# Altium project _stm32h7-hmi-display.PrjPCB (part 1 of 2)
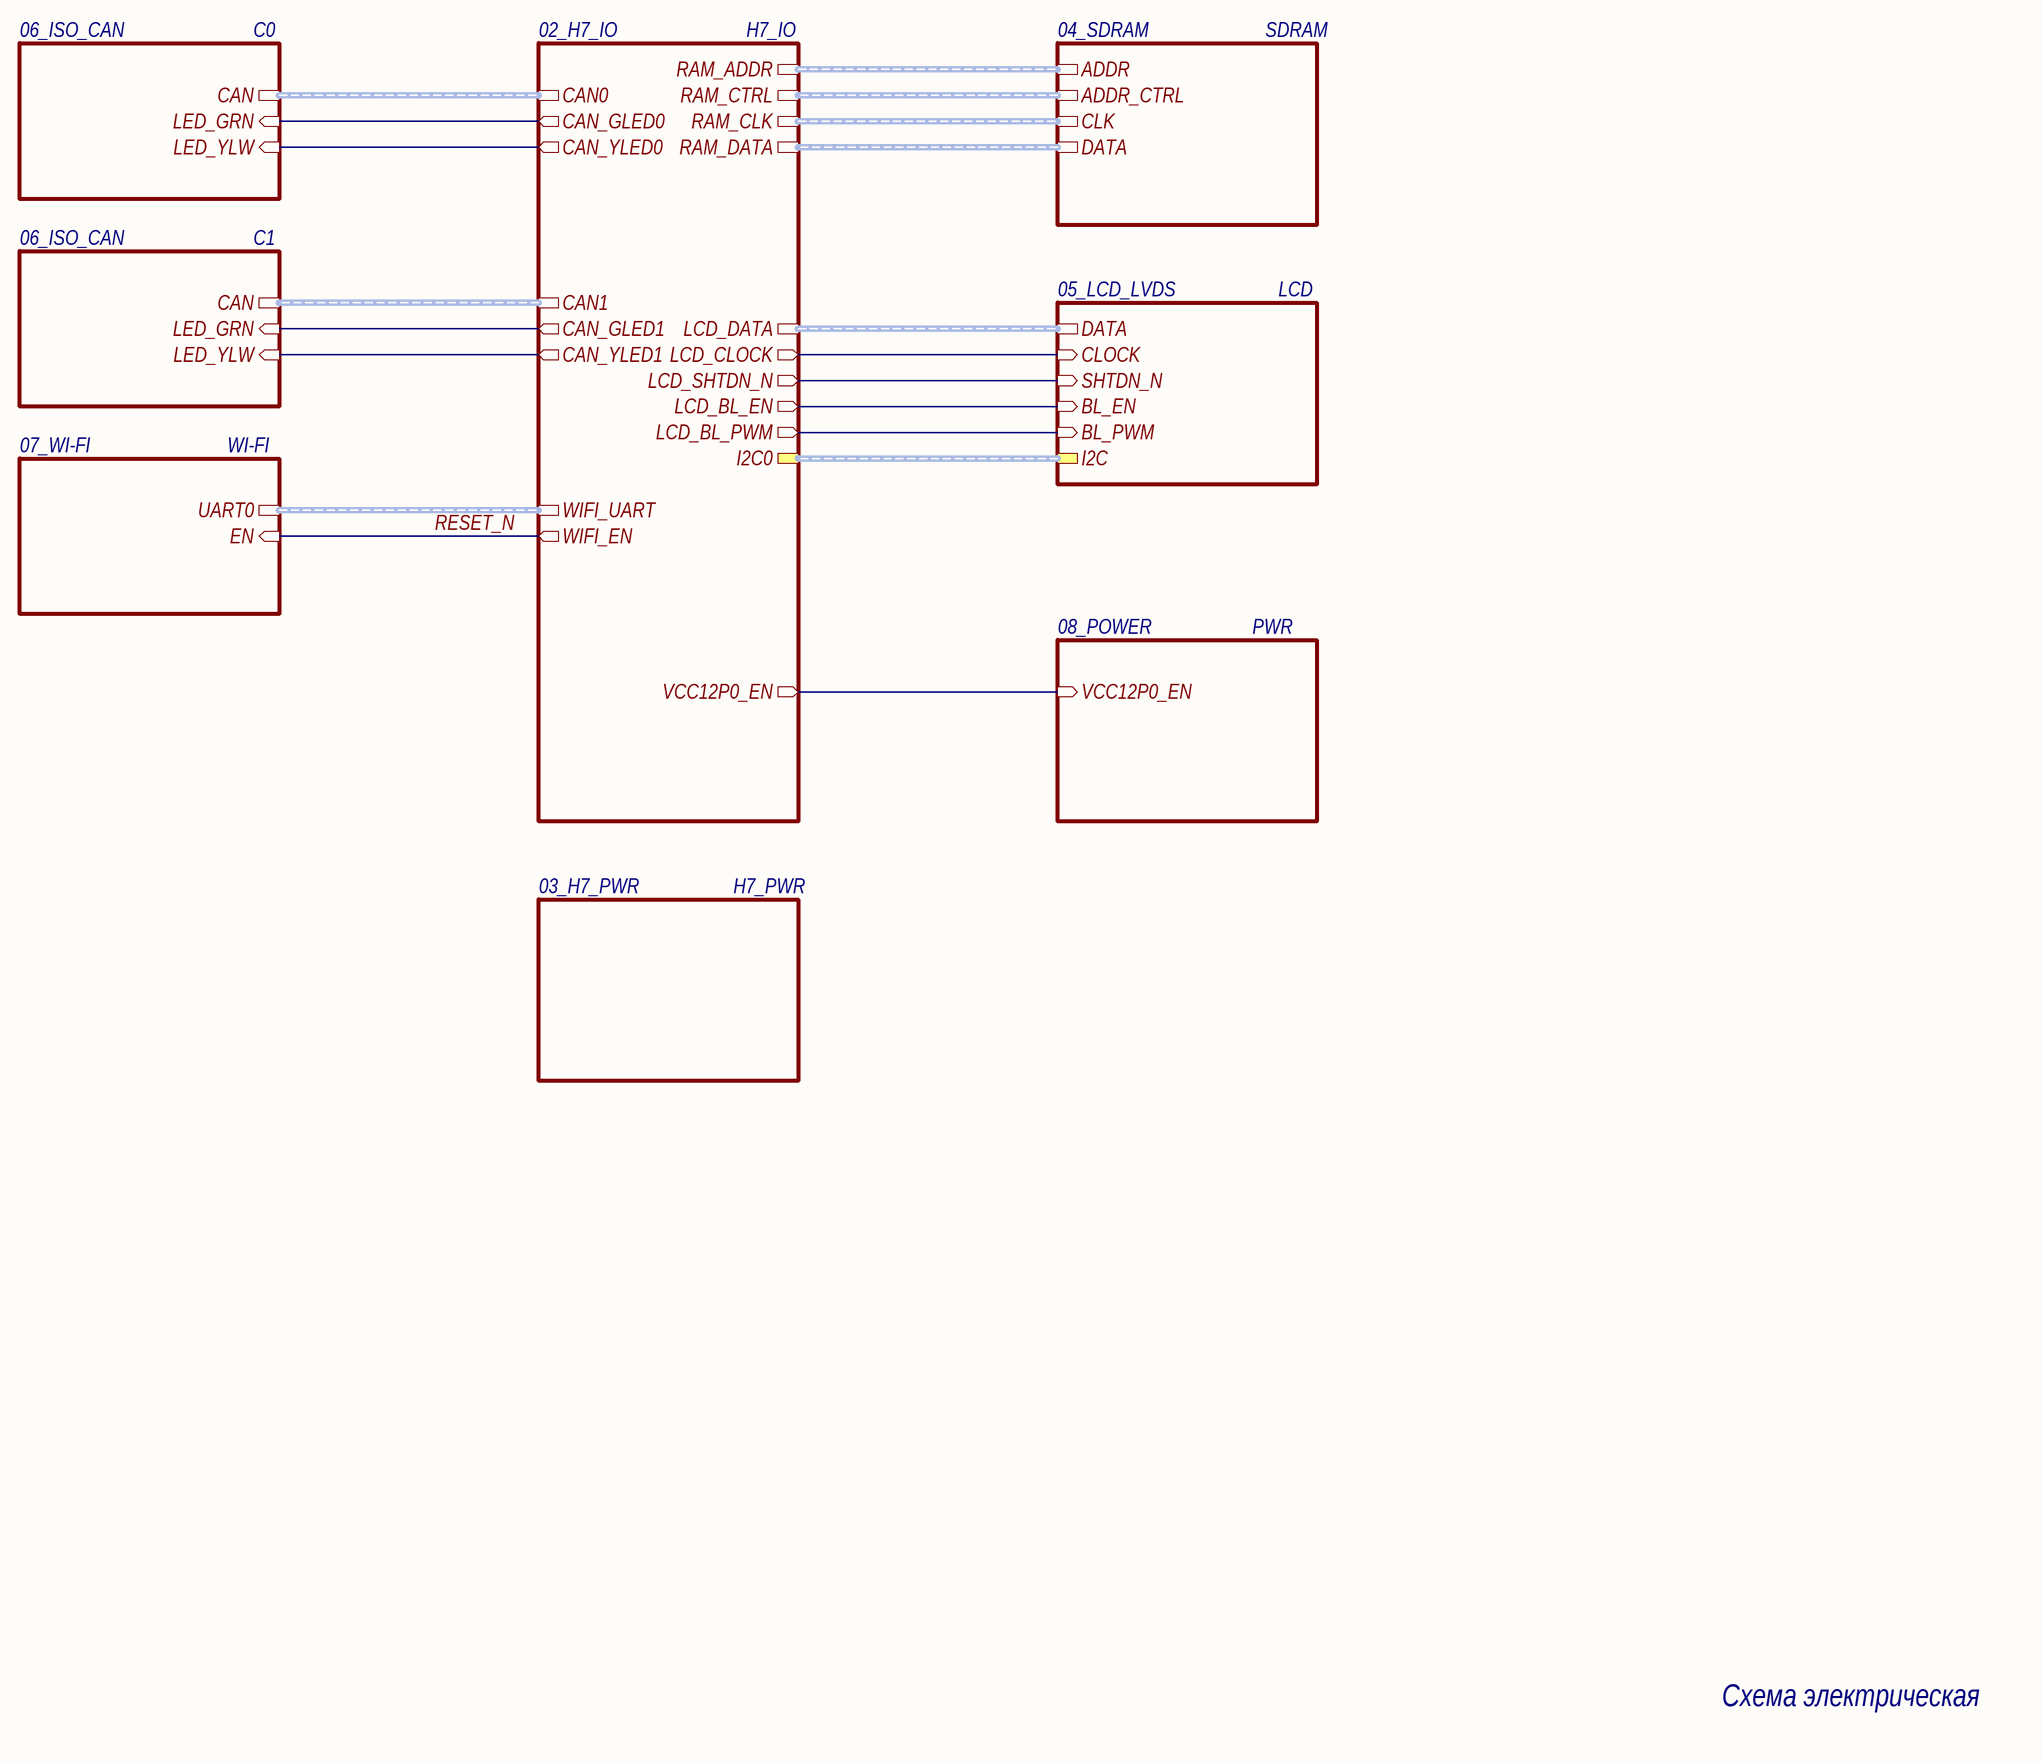
[diagram p0: 01_MAIN.SchDoc]
GlobalOrganizationName: A_D Electronics; GlobalProjectName: stm32h7-hmi-display; GlobalProjectNumber: -; GlobalProjectRevision: 0; PCB_ID: -; PCB_Week: 2024
8 sheets, 164 parts. Net scope: hierarchical (ports join the sheet entries above them; power ports are global).
Board file: PCB.PcbDoc
Sheets:
  01_MAIN.SchDoc
    H7_IO = 02_H7_IO.SchDoc
    SDRAM = 04_SDRAM.SchDoc
    H7_PWR = 03_H7_PWR.SchDoc
    LCD = 05_LCD_LVDS.SchDoc
    C0 = 06_ISO_CAN.SchDoc
    C1 = 06_ISO_CAN.SchDoc
    WI-FI = 07_WI-FI.SchDoc
    PWR = 08_POWER.SchDoc

## Sheet 01_MAIN.SchDoc: =GlobalProjectName
size 594 x 420 mm; ApprovedBy: Галкин; CheckedBy: Галкин; Author: Данич; Organization: A_D Electronics; DocumentNumber: - Э3; Revision: 0; SheetNumber: 1; SheetTotal: 8; PageSetup: Record=PageOptions|CenterHorizontal=True|CenterVertical=True|PrintScale=0.70|XCorrection=1.00|YCorrection=1.00|PrintKind=2|BorderSize=5000000|LeftOffset=9000|BottomOffset=10100|Orientation=2|PaperLength=11176|PaperWidth=8636|Scale=100|PaperSource=259|PrintQuality=-3|MediaType=1|DitherType=10|PrintScaleMode=1|PaperKind=A3|PaperIndex=8; FirstApplication: -; DocumentName: stm32h7-hmi-display

### Sub-sheets
C0 = 06_ISO_CAN: CAN (harness CAN), LED_GRN (in), LED_YLW (in)
C1 = 06_ISO_CAN: CAN (harness CAN), LED_GRN (in), LED_YLW (in)
H7_IO = 02_H7_IO: RAM_DATA (harness SDRAM_DQ), RAM_CTRL (harness SDRAM_ADDR_CTRL), RAM_CLK (harness SDRAM_CLK), RAM_ADDR (harness SDRAM_ADDR), LCD_DATA (harness LCD_DQ), LCD_CLOCK (out), LCD_SHTDN_N (out), CAN_GLED1 (out), CAN_YLED0 (out), CAN1 (harness CAN), CAN0 (harness CAN), WIFI_EN (out), CAN_GLED0 (out), WIFI_UART (harness UART0), CAN_YLED1 (out), LCD_BL_EN (out), LCD_BL_PWM (out), VCC12P0_EN (out), I2C0 (harness I2C)
H7_PWR = 03_H7_PWR: no entries
LCD = 05_LCD_LVDS: DATA (harness LCD_DQ), CLOCK (in), SHTDN_N (in), BL_PWM (in), BL_EN (in), I2C (harness I2C)
PWR = 08_POWER: VCC12P0_EN (in)
SDRAM = 04_SDRAM: DATA (harness SDRAM_DQ), ADDR_CTRL (harness SDRAM_ADDR_CTRL), CLK (harness SDRAM_CLK), ADDR (harness SDRAM_ADDR)
WI-FI = 07_WI-FI: EN (in), UART0 (harness UART0)

### Nets
CAN_GLED0: sheet H7_IO/CAN_GLED0, sheet C0/LED_GRN
CAN_GLED1: sheet H7_IO/CAN_GLED1, sheet C1/LED_GRN
CAN_YLED0: sheet H7_IO/CAN_YLED0, sheet C0/LED_YLW
CAN_YLED1: sheet H7_IO/CAN_YLED1, sheet C1/LED_YLW
LCD_BL_EN: sheet H7_IO/LCD_BL_EN, sheet LCD/BL_EN
LCD_BL_PWM: sheet H7_IO/LCD_BL_PWM, sheet LCD/BL_PWM
LCD_CLK: sheet H7_IO/LCD_CLOCK, sheet LCD/CLOCK
LCD_PWR_EN: sheet H7_IO/VCC12P0_EN, sheet PWR/VCC12P0_EN
RESET_N: sheet H7_IO/LCD_SHTDN_N, sheet H7_IO/WIFI_EN, sheet LCD/SHTDN_N, sheet WI-FI/EN  [project net LCD_SHTDN]

### Buses and harness runs
harness sheet C0/CAN = sheet H7_IO/CAN0
harness sheet C1/CAN = sheet H7_IO/CAN1
harness sheet H7_IO/I2C0 = sheet LCD/I2C
harness sheet H7_IO/LCD_DATA = sheet LCD/DATA
harness sheet H7_IO/RAM_ADDR = sheet SDRAM/ADDR
harness sheet H7_IO/RAM_CLK = sheet SDRAM/CLK
harness sheet H7_IO/RAM_CTRL = sheet SDRAM/ADDR_CTRL
harness sheet H7_IO/RAM_DATA = sheet SDRAM/DATA
harness sheet H7_IO/WIFI_UART = sheet WI-FI/UART0

### Notes on the sheet
- Схема электрическая
  принципиальная
- Перв. примен.
- Справ. №
- Подп. и дата
- Инв. № дубл.
- Взам. инв. №
- Разраб.
- Изм.
- Лист
- № докум.
- Подп.
- Дата
- Литера
- Масса
- Масштаб
- Пров.
- Т.контр.
- Листов
- Инв. № подл.
- Н.контр.
- Утв.
- Форма 1 ГОСТ 2.104-2006
- Копировал
- Формат А2

## Sheet 02_H7_IO.SchDoc: =GlobalProjectName
size 594 x 420 mm; ApprovedBy: Галкин; CheckedBy: Галкин; Author: Данич; Organization: A_D Electronics; DocumentNumber: - Э3; Revision: 0; SheetNumber: 2; SheetTotal: 8; PageSetup: Record=PageOptions|CenterHorizontal=True|CenterVertical=True|PrintScale=0.70|XCorrection=1.00|YCorrection=1.00|PrintKind=2|BorderSize=5000000|LeftOffset=9000|BottomOffset=10100|Orientation=2|PaperLength=11176|PaperWidth=8636|Scale=100|PaperSource=259|PrintQuality=-3|MediaType=1|DitherType=10|PrintScaleMode=1|PaperKind=A3|PaperIndex=8; FirstApplication: -; DocumentName: stm32h7-hmi-display
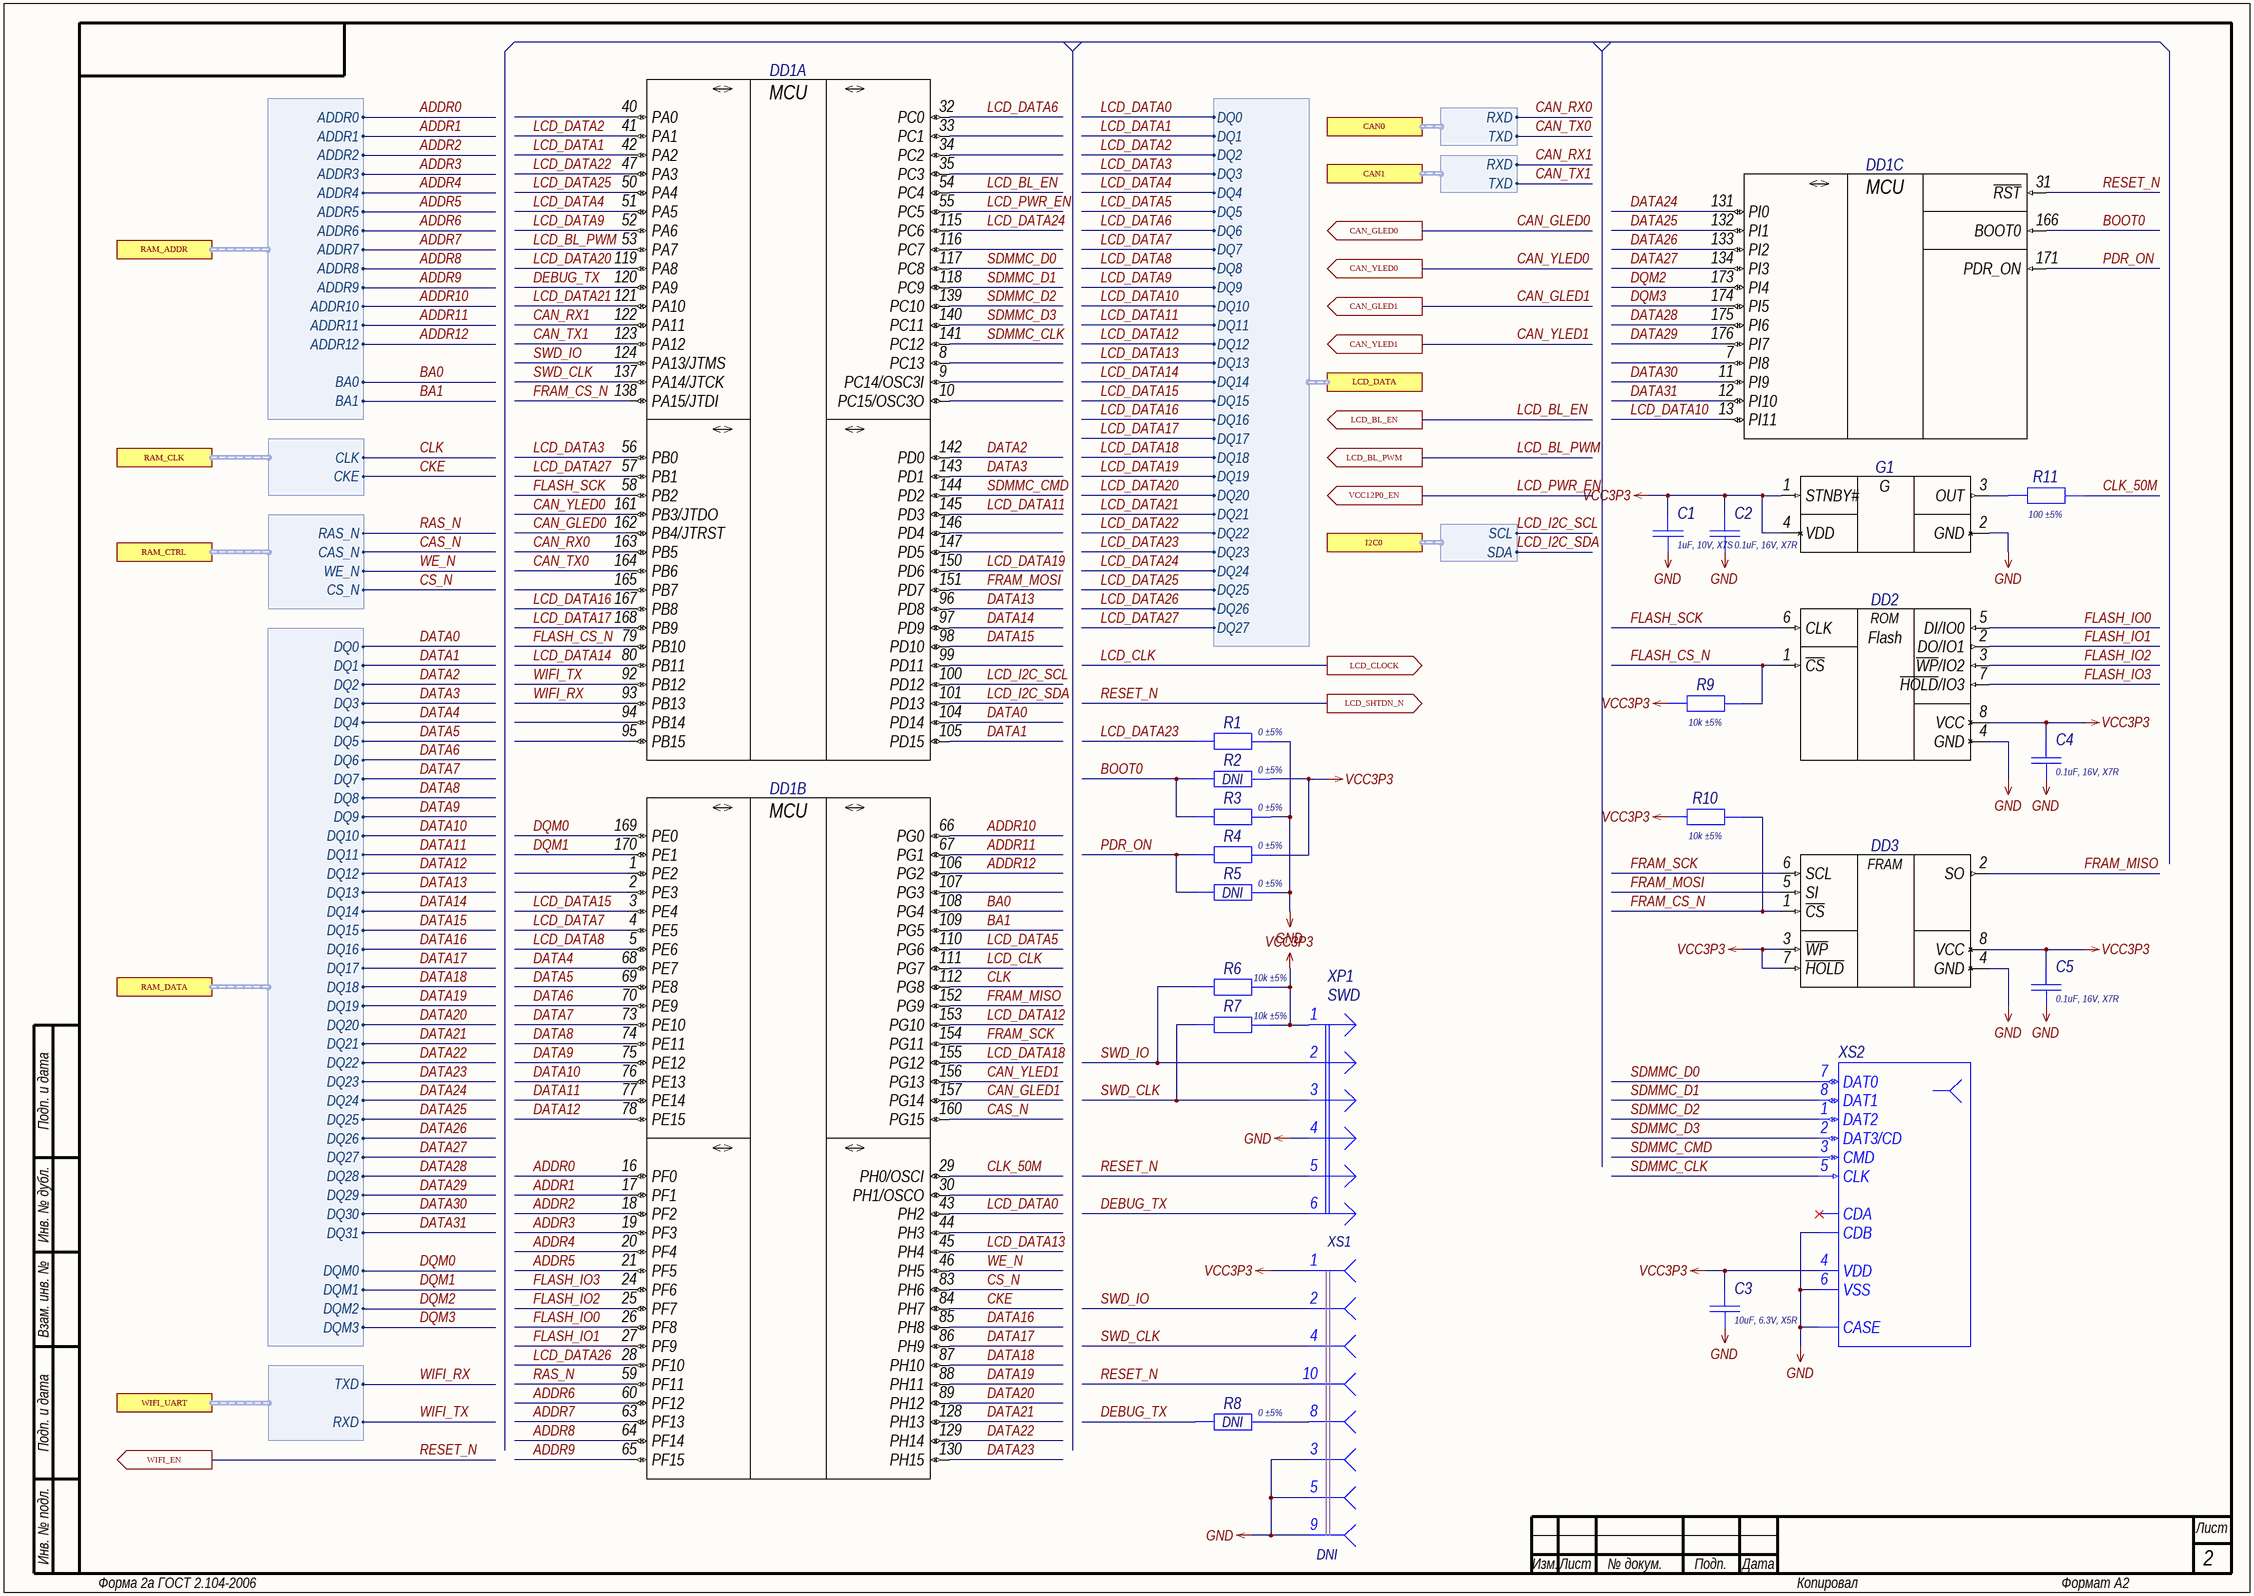
[diagram p1: 02_H7_IO.SchDoc]

### Parts
C1  Schematic Value: 1uF, 10V, X7S  [C0402_L]  (hidden comment: Capacitor)
C2  Schematic Value: 0.1uF, 16V, X7R  [C0402_L]  (hidden comment: Capacitor)
C3  Schematic Value: 10uF, 6.3V, X5R  [C0402_L]  (hidden comment: Capacitor)
C4  Schematic Value: 0.1uF, 16V, X7R  [C0402_L]  (hidden comment: Capacitor)
C5  Schematic Value: 0.1uF, 16V, X7R  [C0402_L]  (hidden comment: Capacitor)
DD1  STM32H743IxT6-Series  [LQFP-176_050P2400X2400X160_N]  (value not drawn)  (parts A,B,C of 4)
DD2  W25Q-Series  [SOIC-8_127P528X528X203_N]  (value not drawn)
DD3  FM25CL64Bx-Series  [SOIC-8_127P490X391X155_N]  (value not drawn)
G1  DSC100X-Series  [CDFN-4_165P250X200X085_N]  (value not drawn)
R1  Schematic Value: 0 ±5%  [R0402_L]  (hidden comment: Resistor)
R2  Schematic Value: 0 ±5%  [R0402_L]  (hidden comment: Resistor)  (no BOM)
R3  Schematic Value: 0 ±5%  [R0402_L]  (hidden comment: Resistor)
R4  Schematic Value: 0 ±5%  [R0402_L]  (hidden comment: Resistor)
R5  Schematic Value: 0 ±5%  [R0402_L]  (hidden comment: Resistor)  (no BOM)
R6  Schematic Value: 10k ±5%  [R0402_L]  (hidden comment: Resistor)
R7  Schematic Value: 10k ±5%  [R0402_L]  (hidden comment: Resistor)
R8  Schematic Value: 0 ±5%  [R0402_L]  (hidden comment: Resistor)  (no BOM)
R9  Schematic Value: 10k ±5%  [R0402_L]  (hidden comment: Resistor)
R10  Schematic Value: 10k ±5%  [R0402_L]  (hidden comment: Resistor)
R11  Schematic Value: 100 ±5%  [R0402_L]  (hidden comment: Resistor)
XP1  SWD  [CWF-6R]
XS1  JTAG  [XF2M-1015-1A]  (value not drawn)  (parts A,B,C,D,E,H,I,J of 10)  (no BOM)
XS2  DM3AT-SF-PEJM5  [DM3AT-SF-PEJM5]  (value not drawn)

### Ports
CAN0 (harness CAN), CAN1 (harness CAN), CAN_GLED0 (out), CAN_GLED1 (out), CAN_YLED0 (out), CAN_YLED1 (out), I2C0 (harness I2C), LCD_BL_EN (out), LCD_BL_PWM (out), LCD_CLOCK (out), LCD_DATA (harness LCD_DQ), LCD_SHTDN_N (out), RAM_ADDR (harness SDRAM_ADDR), RAM_CLK (harness SDRAM_CLK), RAM_CTRL (harness SDRAM_ADDR_CTRL), RAM_DATA (harness SDRAM_DQ), VCC12P0_EN (out), WIFI_EN (out), WIFI_UART (harness UART0)

### Harnesses
SDRAM_ADDR: BA0, BA1, ADDR12, ADDR11, ADDR10, ADDR9, ADDR8, ADDR7, ADDR6, ADDR5, ADDR4, ADDR3, ADDR2, ADDR1, ADDR0
SDRAM_ADDR_CTRL: RAS_N, CAS_N, WE_N, CS_N
SDRAM_CLK: CLK, CKE
SDRAM_DQ: DQ0, DQ1, DQ2, DQ3, DQ4, DQ5, DQ6, DQ7, DQ8, DQ9, DQ10, DQ11, DQ12, DQ13, DQ14, DQ15, DQ16, DQ17, DQ18, DQ19, DQ20, DQ21, DQ22, DQ23, DQ24, DQ25, DQ26, DQ27, DQ28, DQ29, DQ30, DQ31, DQM0, DQM1, DQM2, DQM3
LCD_DQ: DQ0, DQ1, DQ2, DQ3, DQ4, DQ5, DQ6, DQ7, DQ8, DQ9, DQ10, DQ11, DQ12, DQ13, DQ14, DQ15, DQ16, DQ17, DQ18, DQ19, DQ20, DQ21, DQ22, DQ23, DQ24, DQ25, DQ26, DQ27
UART0: RXD, TXD
CAN: RXD, TXD
I2C: SCL, SDA

### Nets
GND: C1.1 C2.1 C3.1 C4.1 C5.1 DD2.4(GND) DD3.4(GND) G1.2(GND) R1.2 R3.2 R5.2 XP1.4 XS1.3 XS1.5 XS1.9 XS2.6(VSS) XS2.CASE XS2.CDB
VCC3P3: C1.2 C2.2 C3.2 C4.2 C5.2 DD2.8(VCC) DD3.3(~{WP}) DD3.7(~{HOLD}) DD3.8(VCC) G1.1(STNBY#) G1.4(VDD) R2.2 R4.2 R6.1 R7.1 R9.2 R10.2 XP1.1 XS1.1 XS2.4(VDD)
ADDR0: DD1.16(PF0) ; port RAM_ADDR.ADDR0
ADDR1: DD1.17(PF1) ; port RAM_ADDR.ADDR1
ADDR2: DD1.18(PF2) ; port RAM_ADDR.ADDR2
ADDR3: DD1.19(PF3) ; port RAM_ADDR.ADDR3
ADDR4: DD1.20(PF4) ; port RAM_ADDR.ADDR4
ADDR5: DD1.21(PF5) ; port RAM_ADDR.ADDR5
ADDR6: DD1.60(PF12) ; port RAM_ADDR.ADDR6
ADDR7: DD1.63(PF13) ; port RAM_ADDR.ADDR7
ADDR8: DD1.64(PF14) ; port RAM_ADDR.ADDR8
ADDR9: DD1.65(PF15) ; port RAM_ADDR.ADDR9
ADDR10: DD1.66(PG0) ; port RAM_ADDR.ADDR10
ADDR11: DD1.67(PG1) ; port RAM_ADDR.ADDR11
ADDR12: DD1.106(PG2) ; port RAM_ADDR.ADDR12
BA0: DD1.108(PG4) ; port RAM_ADDR.BA0
BA1: DD1.109(PG5) ; port RAM_ADDR.BA1
BOOT0: DD1.166(BOOT0) R2.1 R3.1
CAN_GLED0: DD1.162(PB4/JTRST) ; port CAN_GLED0
CAN_GLED1: DD1.157(PG14) ; port CAN_GLED1
CAN_RX0: DD1.163(PB5) ; port CAN0.RXD
CAN_RX1: DD1.122(PA11) ; port CAN1.RXD
CAN_TX0: DD1.164(PB6) ; port CAN0.TXD
CAN_TX1: DD1.123(PA12) ; port CAN1.TXD
CAN_YLED0: DD1.161(PB3/JTDO) ; port CAN_YLED0
CAN_YLED1: DD1.156(PG13) ; port CAN_YLED1
CAS_N: DD1.160(PG15) ; port RAM_CTRL.CAS_N
CKE: DD1.84(PH7) ; port RAM_CLK.CKE
CLK: DD1.112(PG8) ; port RAM_CLK.CLK
CLK_50M: DD1.29(PH0/OSCI) R11.2
CS_N: DD1.83(PH6) ; port RAM_CTRL.CS_N
DATA0: DD1.104(PD14) ; port RAM_DATA.DQ0
DATA1: DD1.105(PD15) ; port RAM_DATA.DQ1
DATA2: DD1.142(PD0) ; port RAM_DATA.DQ2
DATA3: DD1.143(PD1) ; port RAM_DATA.DQ3
DATA4: DD1.68(PE7) ; port RAM_DATA.DQ4
DATA5: DD1.69(PE8) ; port RAM_DATA.DQ5
DATA6: DD1.70(PE9) ; port RAM_DATA.DQ6
DATA7: DD1.73(PE10) ; port RAM_DATA.DQ7
DATA8: DD1.74(PE11) ; port RAM_DATA.DQ8
DATA9: DD1.75(PE12) ; port RAM_DATA.DQ9
DATA10: DD1.76(PE13) ; port RAM_DATA.DQ10
DATA11: DD1.77(PE14) ; port RAM_DATA.DQ11
DATA12: DD1.78(PE15) ; port RAM_DATA.DQ12
DATA13: DD1.96(PD8) ; port RAM_DATA.DQ13
DATA14: DD1.97(PD9) ; port RAM_DATA.DQ14
DATA15: DD1.98(PD10) ; port RAM_DATA.DQ15
DATA16: DD1.85(PH8) ; port RAM_DATA.DQ16
DATA17: DD1.86(PH9) ; port RAM_DATA.DQ17
DATA18: DD1.87(PH10) ; port RAM_DATA.DQ18
DATA19: DD1.88(PH11) ; port RAM_DATA.DQ19
DATA20: DD1.89(PH12) ; port RAM_DATA.DQ20
DATA21: DD1.128(PH13) ; port RAM_DATA.DQ21
DATA22: DD1.129(PH14) ; port RAM_DATA.DQ22
DATA23: DD1.130(PH15) ; port RAM_DATA.DQ23
DATA24: DD1.131(PI0) ; port RAM_DATA.DQ24
DATA25: DD1.132(PI1) ; port RAM_DATA.DQ25
DATA26: DD1.133(PI2) ; port RAM_DATA.DQ26
DATA27: DD1.134(PI3) ; port RAM_DATA.DQ27
DATA28: DD1.175(PI6) ; port RAM_DATA.DQ28
DATA29: DD1.176(PI7) ; port RAM_DATA.DQ29
DATA30: DD1.11(PI9) ; port RAM_DATA.DQ30
DATA31: DD1.12(PI10) ; port RAM_DATA.DQ31
DEBUG_TX: DD1.120(PA9) R8.1 XP1.6
DQM0: DD1.169(PE0) ; port RAM_DATA.DQM0
DQM1: DD1.170(PE1) ; port RAM_DATA.DQM1
DQM2: DD1.173(PI4) ; port RAM_DATA.DQM2
DQM3: DD1.174(PI5) ; port RAM_DATA.DQM3
FLASH_CS_N: DD1.79(PB10) DD2.1(~{CS}) R9.1
FLASH_IO0: DD1.26(PF8) DD2.5(DI/IO0)
FLASH_IO1: DD1.27(PF9) DD2.2(DO/IO1)
FLASH_IO2: DD1.25(PF7) DD2.3(~{WP}/IO2)
FLASH_IO3: DD1.24(PF6) DD2.7(~{HOLD}/IO3)
FLASH_SCK: DD1.58(PB2) DD2.6(CLK)
FRAM_CS_N: DD1.138(PA15/JTDI) DD3.1(~{CS}) R10.1
FRAM_MISO: DD1.152(PG9) DD3.2(SO)
FRAM_MOSI: DD1.151(PD7) DD3.5(SI)
FRAM_SCK: DD1.154(PG11) DD3.6(SCL)
LCD_BL_EN: DD1.54(PC4) ; port LCD_BL_EN
LCD_BL_PWM: DD1.53(PA7) ; port LCD_BL_PWM
LCD_CLK: DD1.111(PG7) ; port LCD_CLOCK
LCD_DATA0: DD1.43(PH2) ; port LCD_DATA.DQ0
LCD_DATA1: DD1.42(PA2) ; port LCD_DATA.DQ1
LCD_DATA2: DD1.41(PA1) ; port LCD_DATA.DQ2
LCD_DATA3: DD1.56(PB0) ; port LCD_DATA.DQ3
LCD_DATA4: DD1.51(PA5) ; port LCD_DATA.DQ4
LCD_DATA5: DD1.110(PG6) ; port LCD_DATA.DQ5
LCD_DATA6: DD1.32(PC0) ; port LCD_DATA.DQ6
LCD_DATA7: DD1.4(PE5) ; port LCD_DATA.DQ7
LCD_DATA8: DD1.5(PE6) ; port LCD_DATA.DQ8
LCD_DATA9: DD1.52(PA6) ; port LCD_DATA.DQ9
LCD_DATA10: DD1.13(PI11) ; port LCD_DATA.DQ10
LCD_DATA11: DD1.145(PD3) ; port LCD_DATA.DQ11
LCD_DATA12: DD1.153(PG10) ; port LCD_DATA.DQ12
LCD_DATA13: DD1.45(PH4) ; port LCD_DATA.DQ13
LCD_DATA14: DD1.80(PB11) ; port LCD_DATA.DQ14
LCD_DATA15: DD1.3(PE4) ; port LCD_DATA.DQ15
LCD_DATA16: DD1.167(PB8) ; port LCD_DATA.DQ16
LCD_DATA17: DD1.168(PB9) ; port LCD_DATA.DQ17
LCD_DATA18: DD1.155(PG12) ; port LCD_DATA.DQ18
LCD_DATA19: DD1.150(PD6) ; port LCD_DATA.DQ19
LCD_DATA20: DD1.119(PA8) ; port LCD_DATA.DQ20
LCD_DATA21: DD1.121(PA10) ; port LCD_DATA.DQ21
LCD_DATA22: DD1.47(PA3) ; port LCD_DATA.DQ22
LCD_DATA23: R1.1 ; port LCD_DATA.DQ23
LCD_DATA24: DD1.115(PC6) ; port LCD_DATA.DQ24
LCD_DATA25: DD1.50(PA4) ; port LCD_DATA.DQ25
LCD_DATA26: DD1.28(PF10) ; port LCD_DATA.DQ26
LCD_DATA27: DD1.57(PB1) ; port LCD_DATA.DQ27
LCD_I2C_SCL: DD1.100(PD12) ; port I2C0.SCL
LCD_I2C_SDA: DD1.101(PD13) ; port I2C0.SDA
LCD_PWR_EN: DD1.55(PC5) ; port VCC12P0_EN
PDR_ON: DD1.171(PDR_ON) R4.1 R5.1
RAS_N: DD1.59(PF11) ; port RAM_CTRL.RAS_N
RESET_N: DD1.31(~{RST}) XP1.5 XS1.10 ; port LCD_SHTDN_N, port WIFI_EN  [project net LCD_SHTDN]
SDMMC_CLK: DD1.141(PC12) XS2.5(CLK)
SDMMC_CMD: DD1.144(PD2) XS2.3(CMD)
SDMMC_D0: DD1.117(PC8) XS2.7(DAT0)
SDMMC_D1: DD1.118(PC9) XS2.8(DAT1)
SDMMC_D2: DD1.139(PC10) XS2.1(DAT2)
SDMMC_D3: DD1.140(PC11) XS2.2(DAT3/CD)
SWD_CLK: DD1.137(PA14/JTCK) R7.2 XP1.3 XS1.4
SWD_IO: DD1.124(PA13/JTMS) R6.2 XP1.2 XS1.2
WE_N: DD1.46(PH5) ; port RAM_CTRL.WE_N
WIFI_RX: DD1.93(PB13) ; port WIFI_UART.TXD
WIFI_TX: DD1.92(PB12) ; port WIFI_UART.RXD
NetG1_3: G1.3(OUT) R11.1
NetR8_2: R8.2 XS1.8

Not connected (* = marked no-connect by the designer): DD1 1(PE2) 2(PE3) 7(PI8) 8(PC13) 9(PC14/OSC3I) 10(PC15/OSC3O) 30(PH1/OSCO) 33(PC1) 34(PC2) 35(PC3) 40(PA0) 44(PH3) 94(PB14) 95(PB15) 99(PD11) 107(PG3) 116(PC7) 146(PD4) 147(PD5) 165(PB7); XS2 CDA*

### Notes on the sheet
- (near R2) DNI
- (near R5) DNI
- XS1
- (near R8) DNI
- (near XS1) DNI
- Подп. и дата
- Инв. № дубл.
- Взам. инв. №
- Инв. № подл.
- Изм.
- Лист
- № докум.
- Подп.
- Дата
- Форма 2а ГОСТ 2.104-2006
- Копировал
- Формат А2
- (in symbol DSC1001DI5-050.0000) G
- (in symbol FM25CL64B-G) FRAM
- (in symbol STM32H743IIT6, part A) MCU
- (in symbol STM32H743IIT6, part B) MCU
- (in symbol STM32H743IIT6, part C) MCU
- (in symbol W25Q128JVSIQ) ROM; Flash

### Library data of the parts
C1 = GRM155C71A105KE11D: Manufacturer: Murata; Type: Конденсатор; ID: 179; Value: 1uF; Voltage: 10V; Tolerance: ±10%; Dielectric Type: X7S; Application Category: 1; Working Temperature Min: -55°С; Working Temperature Max: +125°С; Published: 18.05.2010; Publisher: Andrew Danich; Part Number: GRM155C71A105KE11D; Footprint: 0402
C2 C4 C5 = GCM155R71C104KA55D: Manufacturer: Murata; Type: Конденсатор; ID: 163; Value: 0.1uF; Voltage: 16V; Tolerance: ±10%; Dielectric Type: X7R; Application Category: 1; Working Temperature Min: -55°С; Working Temperature Max: +125°С; Functional Analog: GRM155R71C104KA88D; Published: 18.05.2010; Publisher: Andrew Danich; Part Number: GCM155R71C104KA55D; Footprint: 0402
C3 = GRM155R60J106ME15D: Manufacturer: Murata; Type: Конденсатор; ID: 234; Value: 10uF; Voltage: 6.3V; Tolerance: ±20%; Dielectric Type: X5R; Application Category: 1; Working Temperature Min: -55°С; Working Temperature Max: +85°С; Published: 18.05.2010; Publisher: Andrew Danich; Part Number: GRM155R60J106ME15D; Footprint: 0402
DD1 = STM32H743IIT6: Manufacturer: STMicroelectronics; ID: 36; Supply Operation: +1.62…3.6V; Flash: 2M; SRAM: 1M; Prog Interface: JTAG, SWD, UART, USB; I/O Lines: 140; Operation Frequency: 400MHz; Application Category: 1; Working Temperature Min: -40°С; Working Temperature Max: +85°С; Published: 19.05.2020; Publisher: Andrew Danich; Type: Микросхема; Part Number: STM32H743IIT6; Value: STM32H743IIT6
DD2 = W25Q128JVSIQ: Manufacturer: Winbond; ID: 21; Supply Operation: +2.7…3.6V; Supply Current: 25mA; Memory: 16M; Addressable: NO; Clock Frequency: 133MHz; Application Category: 1; Working Temperature Min: -40°С; Working Temperature Max: +85°С; Interface: SPI; Published: 11.06.2017; Type: Микросхема; Publisher: Andrew Danich; Part Number: W25Q128JVSIQ; Value: W25Q128JVSIQ
DD3 = FM25CL64B-G: Manufacturer: Cypress Semiconductor; ID: 2; Supply Operation: +2.7…3.6V; Supply Current: 3mA; Memory: 64Kb; Addressable: NO; Interface: SPI; Clock Frequency: 20MHz; Application Category: 1; Working Temperature Min: -40°С; Working Temperature Max: +85°С; Functional Analog: FM25CL64B-GTR; Published: 21.05.2020; Type: Микросхема; Publisher: Andrew Danich; Part Number: FM25CL64B-G; Value: FM25CL64B-G
G1 = DSC1001DI5-050.0000: Manufacturer: Microchip; ID: 12; Supply Operation: +1.7…3.6V; Supply Current: 8.5mA; Output Voltage: 0.2VCC…0.8VCC; Temperature Coefficient: 10ppm; Shutdown Input: Yes; Output Signal: CMOS; Output Frequency: 50MHz; Application Category: 1; Working Temperature Min: -40°С; Working Temperature Max: +85°С; Functional Analog: DSC1001DI5-050.0000T; Published: 07.06.2018; Publisher: Andrew Danich; Type: Генератор; Part Number: DSC1001DI5-050.0000; Value: DSC1001DI5-050.0000
R1-R5 R8 = RC0402JR-070RL: Manufacturer: Yageo; ID: 362; Value: 0; Limit Voltage: 50V; Tolerance: ±5%; Temperature Coefficient: 100ppm; Total Power Dissipation: 0.1W; Series Type: Thick-Film; Application Category: 1; Working Temperature Min: -55°С; Working Temperature Max: +155°С; Published: 24.03.2010; Publisher: Andrew Danich; Type: Резистор; Part Number: RC0402JR-070RL; Footprint: 0402
R6 R7 R9 R10 = RC0402JR-0710KL: Manufacturer: Yageo; ID: 476; Value: 10k; Limit Voltage: 50V; Tolerance: ±5%; Temperature Coefficient: 100ppm; Total Power Dissipation: 0.1W; Series Type: Thick-Film; Application Category: 1; Working Temperature Min: -55°С; Working Temperature Max: +155°С; Published: 24.03.2010; Publisher: Andrew Danich; Type: Резистор; Part Number: RC0402JR-0710KL; Footprint: 0402
R11 = RC0402JR-07100RL: Manufacturer: Yageo; ID: 479; Value: 100; Limit Voltage: 50V; Tolerance: ±5%; Temperature Coefficient: 100ppm; Total Power Dissipation: 0.1W; Series Type: Thick-Film; Application Category: 1; Working Temperature Min: -55°С; Working Temperature Max: +155°С; Published: 24.03.2010; Publisher: Andrew Danich; Type: Резистор; Part Number: RC0402JR-07100RL; Footprint: 0402
XP1 = CWF-6R: Manufacturer: Ningbo Zhenqin Electronic; Value: CWF-6R; ID: 128; Limit Voltage: 250V; Limit Current: 3A; Connector Type: Male; Surface Finish: Phosphor Bronze; Pitch: 2.5mm; Application Category: 1; Working Temperature Min: -30°С; Working Temperature Max: +90°С; Functional Analog: DS1069-6 MR; Published: 07.03.2013; Publisher: Andrew Danich; Type: Вилка; Part Number: CWF-6R; Pins: 6
XS1 = XF2M-1015-1A: Manufacturer: Omron Electronics; ID: 7; Limit Voltage: 50V; Limit Current: 500mA; Connector Type: Female; Resistance: 0.05ohm; Pitch: 0.5mm; Application Category: 1; Working Temperature Min: -30°С; Working Temperature Max: +85°С; Published: 07.09.2015; Publisher: Viktor Klishin; Type: Розетка; Part Number: XF2M-1015-1A; Value: XF2M-1015-1A; Pins: 10; Series: FPC
XS2 = DM3AT-SF-PEJM5: Manufacturer: Hirose Connector; ID: 5; Limit Voltage: 125V; Style: Push-Push; Connector Type: microSD Card; Interface: SPI\SDIO; Pitch: 1.1mm; Application Category: 1; Working Temperature Min: -25°С; Working Temperature Max: +85°С; Value: DM3AT-SF-PEJM5; Published: 14.03.2019; Publisher: Andrew Danich; Type: Розетка; Part Number: DM3AT-SF-PEJM5; Pins: 10

## Sheet 04_SDRAM.SchDoc: =GlobalProjectName
size 594 x 420 mm; ApprovedBy: Галкин; CheckedBy: Галкин; Author: Данич; Organization: A_D Electronics; DocumentNumber: - Э3; Revision: 0; SheetNumber: 4; SheetTotal: 8; PageSetup: Record=PageOptions|CenterHorizontal=True|CenterVertical=True|PrintScale=0.70|XCorrection=1.00|YCorrection=1.00|PrintKind=2|BorderSize=5000000|LeftOffset=9000|BottomOffset=10100|Orientation=2|PaperLength=11176|PaperWidth=8636|Scale=100|PaperSource=259|PrintQuality=-3|MediaType=1|DitherType=10|PrintScaleMode=1|PaperKind=A3|PaperIndex=8; FirstApplication: -; DocumentName: stm32h7-hmi-display
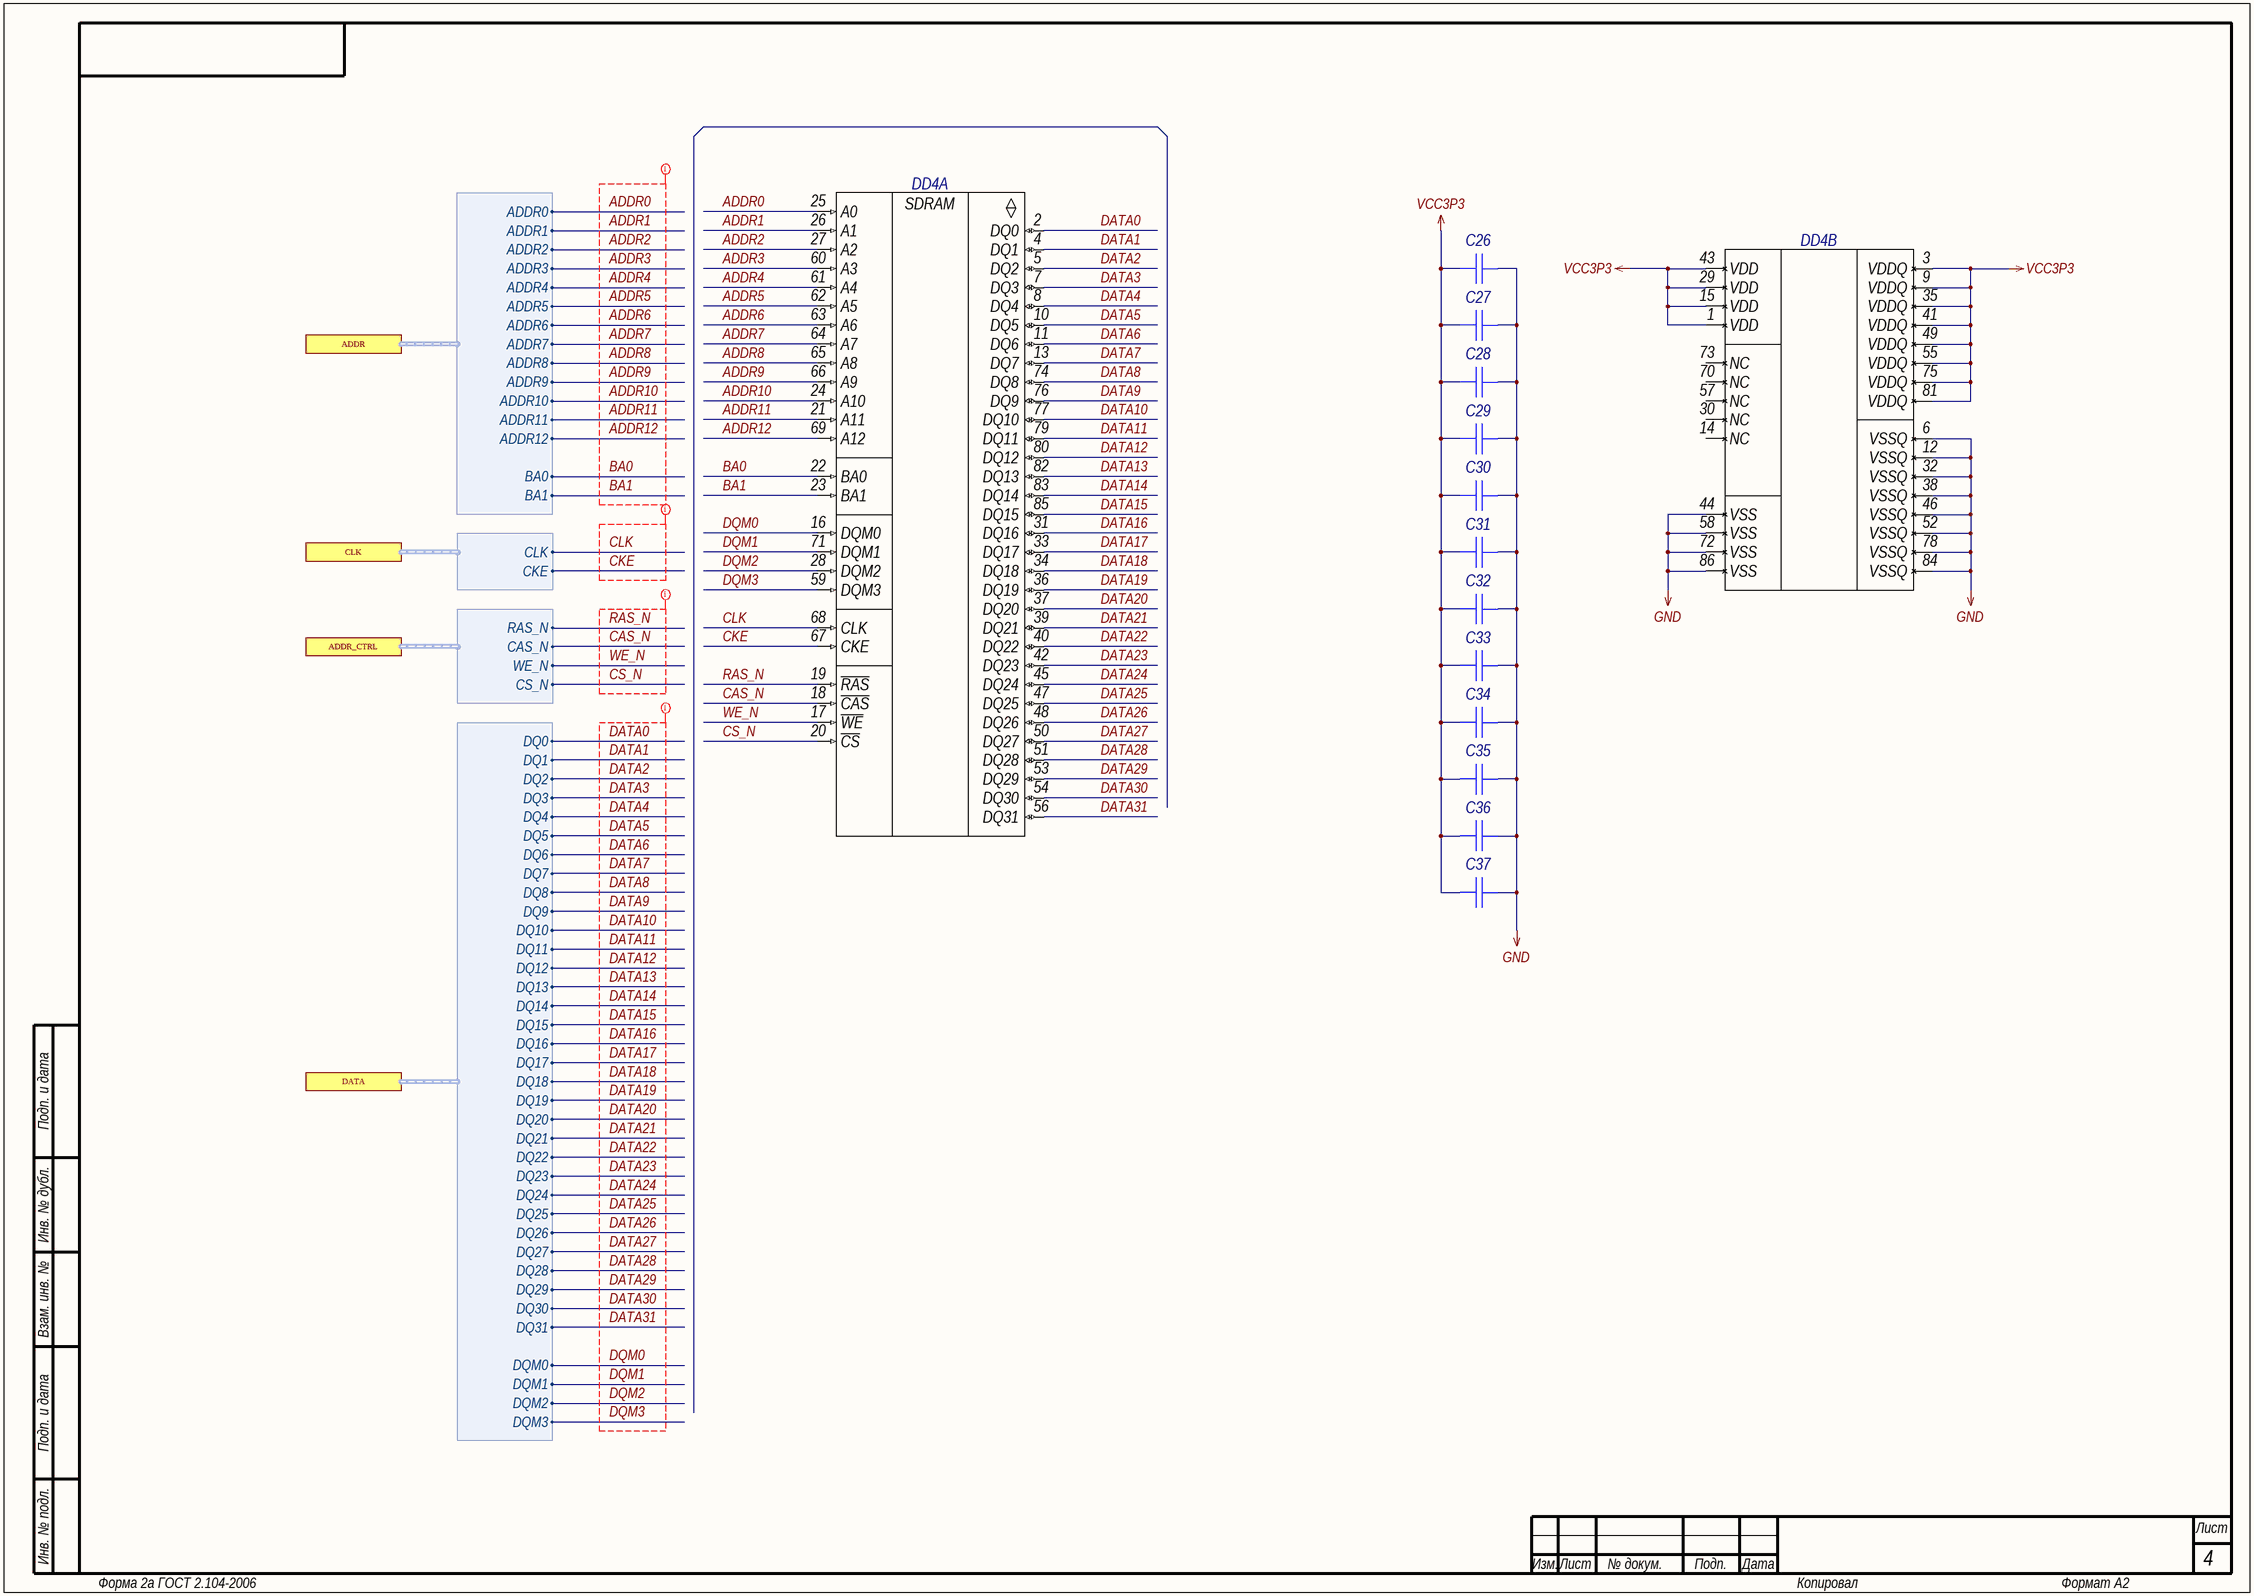
[diagram p2: 04_SDRAM.SchDoc]

### Parts
C26  Capacitor  [C0402_L]  (value not drawn)
C27  Capacitor  [C0402_L]  (value not drawn)
C28  Capacitor  [C0402_L]  (value not drawn)
C29  Capacitor  [C0402_L]  (value not drawn)
C30  Capacitor  [C0402_L]  (value not drawn)
C31  Capacitor  [C0402_L]  (value not drawn)
C32  Capacitor  [C0402_L]  (value not drawn)
C33  Capacitor  [C0402_L]  (value not drawn)
C34  Capacitor  [C0402_L]  (value not drawn)
C35  Capacitor  [C0402_L]  (value not drawn)
C36  Capacitor  [C0402_L]  (value not drawn)
C37  Capacitor  [C0402_L]  (value not drawn)
DD4  IS4xS32160F-xTxx-Series  [TSOP2-86_050P2222X1016X125_N]  (value not drawn)  (parts A,B of 2)

### Ports
ADDR (harness SDRAM_ADDR), ADDR_CTRL (harness SDRAM_ADDR_CTRL), CLK (harness SDRAM_CLK), DATA (harness SDRAM_DQ)

### Harnesses
SDRAM_ADDR: BA0, BA1, ADDR12, ADDR11, ADDR10, ADDR9, ADDR8, ADDR7, ADDR6, ADDR5, ADDR4, ADDR3, ADDR2, ADDR1, ADDR0
SDRAM_ADDR_CTRL: RAS_N, CAS_N, WE_N, CS_N
SDRAM_CLK: CLK, CKE
SDRAM_DQ: DQ0, DQ1, DQ2, DQ3, DQ4, DQ5, DQ6, DQ7, DQ8, DQ9, DQ10, DQ11, DQ12, DQ13, DQ14, DQ15, DQ16, DQ17, DQ18, DQ19, DQ20, DQ21, DQ22, DQ23, DQ24, DQ25, DQ26, DQ27, DQ28, DQ29, DQ30, DQ31, DQM0, DQM1, DQM2, DQM3

### Nets
GND: C26.2 C27.2 C28.2 C29.2 C30.2 C31.2 C32.2 C33.2 C34.2 C35.2 C36.2 C37.2 DD4.6(VSSQ) DD4.12(VSSQ) DD4.32(VSSQ) DD4.38(VSSQ) DD4.44(VSS) DD4.46(VSSQ) DD4.52(VSSQ) DD4.58(VSS) DD4.72(VSS) DD4.78(VSSQ) DD4.84(VSSQ) DD4.86(VSS)
VCC3P3: C26.1 C27.1 C28.1 C29.1 C30.1 C31.1 C32.1 C33.1 C34.1 C35.1 C36.1 C37.1 DD4.1(VDD) DD4.3(VDDQ) DD4.9(VDDQ) DD4.15(VDD) DD4.29(VDD) DD4.35(VDDQ) DD4.41(VDDQ) DD4.43(VDD) DD4.49(VDDQ) DD4.55(VDDQ) DD4.75(VDDQ) DD4.81(VDDQ)
ADDR0: DD4.25(A0) ; port ADDR.ADDR0
ADDR1: DD4.26(A1) ; port ADDR.ADDR1
ADDR2: DD4.27(A2) ; port ADDR.ADDR2
ADDR3: DD4.60(A3) ; port ADDR.ADDR3
ADDR4: DD4.61(A4) ; port ADDR.ADDR4
ADDR5: DD4.62(A5) ; port ADDR.ADDR5
ADDR6: DD4.63(A6) ; port ADDR.ADDR6
ADDR7: DD4.64(A7) ; port ADDR.ADDR7
ADDR8: DD4.65(A8) ; port ADDR.ADDR8
ADDR9: DD4.66(A9) ; port ADDR.ADDR9
ADDR10: DD4.24(A10) ; port ADDR.ADDR10
ADDR11: DD4.21(A11) ; port ADDR.ADDR11
ADDR12: DD4.69(A12) ; port ADDR.ADDR12
BA0: DD4.22(BA0) ; port ADDR.BA0
BA1: DD4.23(BA1) ; port ADDR.BA1
CAS_N: DD4.18(~{CAS}) ; port ADDR_CTRL.CAS_N
CKE: DD4.67(CKE) ; port CLK.CKE
CLK: DD4.68(CLK) ; port CLK.CLK
CS_N: DD4.20(~{CS}) ; port ADDR_CTRL.CS_N
DATA0: DD4.2(DQ0) ; port DATA.DQ0
DATA1: DD4.4(DQ1) ; port DATA.DQ1
DATA2: DD4.5(DQ2) ; port DATA.DQ2
DATA3: DD4.7(DQ3) ; port DATA.DQ3
DATA4: DD4.8(DQ4) ; port DATA.DQ4
DATA5: DD4.10(DQ5) ; port DATA.DQ5
DATA6: DD4.11(DQ6) ; port DATA.DQ6
DATA7: DD4.13(DQ7) ; port DATA.DQ7
DATA8: DD4.74(DQ8) ; port DATA.DQ8
DATA9: DD4.76(DQ9) ; port DATA.DQ9
DATA10: DD4.77(DQ10) ; port DATA.DQ10
DATA11: DD4.79(DQ11) ; port DATA.DQ11
DATA12: DD4.80(DQ12) ; port DATA.DQ12
DATA13: DD4.82(DQ13) ; port DATA.DQ13
DATA14: DD4.83(DQ14) ; port DATA.DQ14
DATA15: DD4.85(DQ15) ; port DATA.DQ15
DATA16: DD4.31(DQ16) ; port DATA.DQ16
DATA17: DD4.33(DQ17) ; port DATA.DQ17
DATA18: DD4.34(DQ18) ; port DATA.DQ18
DATA19: DD4.36(DQ19) ; port DATA.DQ19
DATA20: DD4.37(DQ20) ; port DATA.DQ20
DATA21: DD4.39(DQ21) ; port DATA.DQ21
DATA22: DD4.40(DQ22) ; port DATA.DQ22
DATA23: DD4.42(DQ23) ; port DATA.DQ23
DATA24: DD4.45(DQ24) ; port DATA.DQ24
DATA25: DD4.47(DQ25) ; port DATA.DQ25
DATA26: DD4.48(DQ26) ; port DATA.DQ26
DATA27: DD4.50(DQ27) ; port DATA.DQ27
DATA28: DD4.51(DQ28) ; port DATA.DQ28
DATA29: DD4.53(DQ29) ; port DATA.DQ29
DATA30: DD4.54(DQ30) ; port DATA.DQ30
DATA31: DD4.56(DQ31) ; port DATA.DQ31
DQM0: DD4.16(DQM0) ; port DATA.DQM0
DQM1: DD4.71(DQM1) ; port DATA.DQM1
DQM2: DD4.28(DQM2) ; port DATA.DQM2
DQM3: DD4.59(DQM3) ; port DATA.DQM3
RAS_N: DD4.19(~{RAS}) ; port ADDR_CTRL.RAS_N
WE_N: DD4.17(~{WE}) ; port ADDR_CTRL.WE_N

Not connected (* = marked no-connect by the designer): DD4 14(NC) 30(NC) 57(NC) 70(NC) 73(NC)

### Layout directives
net class SDRAM_ADDR: ADDR0, ADDR1, ADDR2, ADDR3, ADDR4, ADDR5, ADDR6, ADDR7, ADDR8, ADDR9, ADDR10, ADDR11, ADDR12, BA0, BA1
net class SDRAM_CLK; net class SDRAM_CTRL: CKE, CLK
net class SDRAM_CTRL: CAS_N, CS_N, RAS_N, WE_N
net class SDRAM_DATA: DATA0, DATA1, DATA2, DATA3, DATA4, DATA5, DATA6, DATA7, DATA8, DATA9, DATA10, DATA11, DATA12, DATA13, DATA14, DATA15, DATA16, DATA17, DATA18, DATA19, DATA20, DATA21, DATA22, DATA23, DATA24, DATA25, DATA26, DATA27, DATA28, DATA29, DATA30, DATA31, DQM0, DQM1, DQM2, DQM3

### Notes on the sheet
- Подп. и дата
- Инв. № дубл.
- Взам. инв. №
- Инв. № подл.
- Изм.
- Лист
- № докум.
- Подп.
- Дата
- Форма 2а ГОСТ 2.104-2006
- Копировал
- Формат А2
- (in symbol IS42S32160F-7TLI, part A) SDRAM

### Library data of the parts
C26 C27 = GRM155R60J106ME15D: Manufacturer: Murata; Type: Конденсатор; Schematic Value: 10uF, 6.3V, X5R; ID: 234; Value: 10uF; Voltage: 6.3V; Tolerance: ±20%; Dielectric Type: X5R; Application Category: 1; Working Temperature Min: -55°С; Working Temperature Max: +85°С; Published: 18.05.2010; Publisher: Andrew Danich; Part Number: GRM155R60J106ME15D; Footprint: 0402
C28-C31 = GCM155R71C104KA55D: Manufacturer: Murata; Type: Конденсатор; Schematic Value: 0.1uF, 16V, X7R; ID: 163; Value: 0.1uF; Voltage: 16V; Tolerance: ±10%; Dielectric Type: X7R; Application Category: 1; Working Temperature Min: -55°С; Working Temperature Max: +125°С; Functional Analog: GRM155R71C104KA88D; Published: 18.05.2010; Publisher: Andrew Danich; Part Number: GCM155R71C104KA55D; Footprint: 0402
C32-C37 = GCM155R71E103KA37D: Manufacturer: Murata; Type: Конденсатор; Schematic Value: 0.01uF, 25V, X7R; ID: 150; Value: 0.01uF; Voltage: 25V; Tolerance: ±10%; Dielectric Type: X7R; Application Category: 1; Working Temperature Min: -55°С; Working Temperature Max: +125°С; Functional Analog: GRM155R71E103KA01D; Published: 18.05.2010; Publisher: Andrew Danich; Part Number: GCM155R71E103KA37D; Footprint: 0402
DD4 = IS42S32160F-7TLI: Manufacturer: ISSI; ID: 6; Supply Operation: +3.0…3.6V; Supply Current: 140mA; Memory: 16M*32; Addressable: Yes; Interface: Parallel; Clock Frequency: 167MHz; Application Category: 1; Working Temperature Min: -40°С; Working Temperature Max: +85°С; Type: Микросхема; Published: 20.05.2020; Publisher: Andrew Danich; Part Number: IS42S32160F-7TLI; Value: IS42S32160F-7TLI

## Sheet 03_H7_PWR.SchDoc: =GlobalProjectName
size 594 x 420 mm; ApprovedBy: Галкин; CheckedBy: Галкин; Author: Данич; Organization: A_D Electronics; DocumentNumber: - Э3; Revision: 0; SheetNumber: 3; SheetTotal: 8; PageSetup: Record=PageOptions|CenterHorizontal=True|CenterVertical=True|PrintScale=0.70|XCorrection=1.00|YCorrection=1.00|PrintKind=2|BorderSize=5000000|LeftOffset=9000|BottomOffset=10100|Orientation=2|PaperLength=11176|PaperWidth=8636|Scale=100|PaperSource=259|PrintQuality=-3|MediaType=1|DitherType=10|PrintScaleMode=1|PaperKind=A3|PaperIndex=8; FirstApplication: -; DocumentName: stm32h7-hmi-display
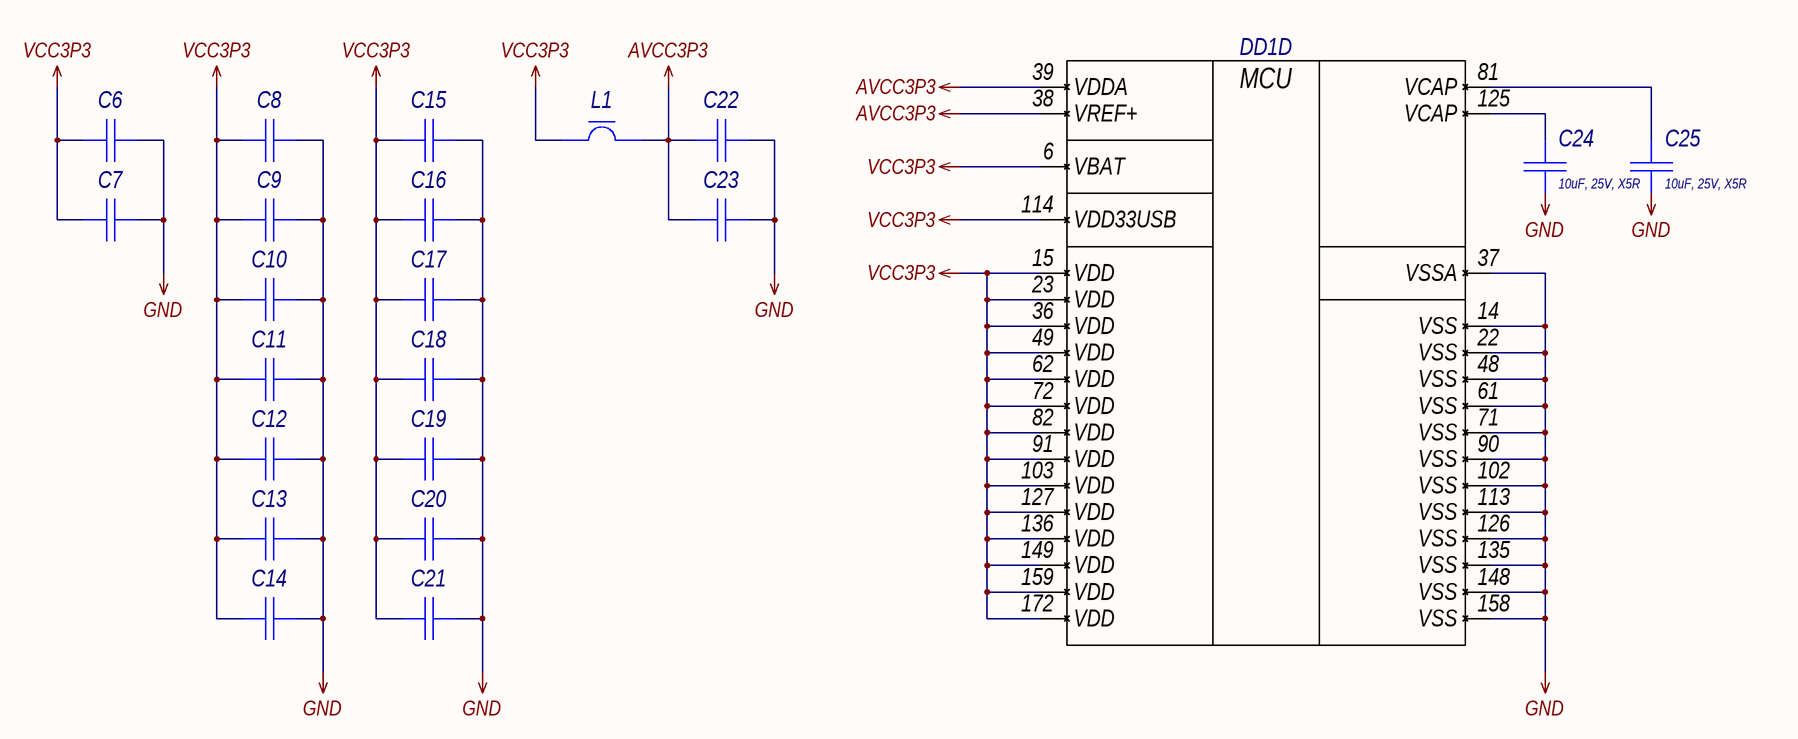
[diagram p3: 03_H7_PWR.SchDoc]

### Parts
C6  Capacitor  [C0402_L]  (value not drawn)
C7  Capacitor  [C0402_L]  (value not drawn)
C8  Capacitor  [C0402_L]  (value not drawn)
C9  Capacitor  [C0402_L]  (value not drawn)
C10  Capacitor  [C0402_L]  (value not drawn)
C11  Capacitor  [C0402_L]  (value not drawn)
C12  Capacitor  [C0402_L]  (value not drawn)
C13  Capacitor  [C0402_L]  (value not drawn)
C14  Capacitor  [C0402_L]  (value not drawn)
C15  Capacitor  [C0402_L]  (value not drawn)
C16  Capacitor  [C0402_L]  (value not drawn)
C17  Capacitor  [C0402_L]  (value not drawn)
C18  Capacitor  [C0402_L]  (value not drawn)
C19  Capacitor  [C0402_L]  (value not drawn)
C20  Capacitor  [C0402_L]  (value not drawn)
C21  Capacitor  [C0402_L]  (value not drawn)
C22  Capacitor  [C0402_L]  (value not drawn)
C23  Capacitor  [C0402_L]  (value not drawn)
C24  Schematic Value: 10uF, 25V, X5R  [C0805_L]  (hidden comment: Capacitor)
C25  Schematic Value: 10uF, 25V, X5R  [C0805_L]  (hidden comment: Capacitor)
DD1  STM32H743IxT6-Series  [LQFP-176_050P2400X2400X160_N]  (value not drawn)  (part D of 4)
L1  FerriteBead  [L0402_L]  (value not drawn)

### Nets
AVCC3P3: C22.1 C23.1 DD1.38(VREF+) DD1.39(VDDA) L1.2
GND: C6.2 C7.2 C8.2 C9.2 C10.2 C11.2 C12.2 C13.2 C14.2 C15.2 C16.2 C17.2 C18.2 C19.2 C20.2 C21.2 C22.2 C23.2 C24.1 C25.1 DD1.14(VSS) DD1.22(VSS) DD1.37(VSSA) DD1.48(VSS) DD1.61(VSS) DD1.71(VSS) DD1.90(VSS) DD1.102(VSS) DD1.113(VSS) DD1.126(VSS) DD1.135(VSS) DD1.148(VSS) DD1.158(VSS)
VCC3P3: C6.1 C7.1 C8.1 C9.1 C10.1 C11.1 C12.1 C13.1 C14.1 C15.1 C16.1 C17.1 C18.1 C19.1 C20.1 C21.1 DD1.6(VBAT) DD1.15(VDD) DD1.23(VDD) DD1.36(VDD) DD1.49(VDD) DD1.62(VDD) DD1.72(VDD) DD1.82(VDD) DD1.91(VDD) DD1.103(VDD) DD1.114(VDD33USB) DD1.127(VDD) DD1.136(VDD) DD1.149(VDD) DD1.159(VDD) DD1.172(VDD) L1.1
NetC24_2: C24.2 DD1.125(VCAP)
NetC25_2: C25.2 DD1.81(VCAP)

### Notes on the sheet
- Подп. и дата
- Инв. № дубл.
- Взам. инв. №
- Инв. № подл.
- Изм.
- Лист
- № докум.
- Подп.
- Дата
- Форма 2а ГОСТ 2.104-2006
- Копировал
- Формат А2
- (in symbol STM32H743IIT6, part D) MCU

### Library data of the parts
C6 C7 = GRM155R61A475MEAAD: Manufacturer: Murata; Type: Конденсатор; Schematic Value: 4.7uF, 10V, X5R; ID: 255; Value: 4.7uF; Voltage: 10V; Tolerance: ±20%; Dielectric Type: X5R; Application Category: 1; Working Temperature Min: -55°С; Working Temperature Max: +85°С; Published: 18.05.2010; Publisher: Andrew Danich; Part Number: GRM155R61A475MEAAD; Footprint: 0402
C8-C21 C23 = GCM155R71C104KA55D: as C28 on sheet 04_SDRAM; Published: 18.05.2010; Publisher: Andrew Danich; Part Number: GCM155R71C104KA55D; Footprint: 0402
C22 = GRM155C71A105KE11D: Manufacturer: Murata; Type: Конденсатор; Schematic Value: 1uF, 10V, X7S; ID: 179; Value: 1uF; Voltage: 10V; Tolerance: ±10%; Dielectric Type: X7S; Application Category: 1; Working Temperature Min: -55°С; Working Temperature Max: +125°С; Published: 18.05.2010; Publisher: Andrew Danich; Part Number: GRM155C71A105KE11D; Footprint: 0402
C24 C25 = GRM21BR61E106KA73L: Manufacturer: Murata; Type: Конденсатор; ID: 53; Value: 10uF; Voltage: 25V; Tolerance: ±10%; Dielectric Type: X5R; Application Category: 1; Published: 18.05.2010; Publisher: Andrew Danich; Part Number: GRM21BR61E106KA73L; Footprint: 0805
DD1 = STM32H743IIT6: as DD1 on sheet 02_H7_IO; Published: 19.05.2020; Publisher: Andrew Danich; Type: Микросхема; Part Number: STM32H743IIT6; Value: STM32H743IIT6
L1 = BLM15HD601SH1D: Manufacturer: Murata; Type: Дроссель; ID: 9; Rated Current: 300mA; Impedance at 100Mhz: 600ohm; Tolerance: ±25%; DC Resistance: 0.85ohm; Inductor Type: EMIFIL; Application Category: 1; Working Temperature Min: -55°С; Working Temperature Max: +125°С; Published: 14.11.2014; Publisher: Andrew Danich; Part Number: BLM15HD601SH1D; Value: BLM15HD601SH1D; Footprint: 0402

## Sheet 05_LCD_LVDS.SchDoc: =GlobalProjectName
size 594 x 420 mm; ApprovedBy: Галкин; CheckedBy: Галкин; Author: Данич; Organization: A_D Electronics; DocumentNumber: - Э3; Revision: 0; SheetNumber: 5; SheetTotal: 8; PageSetup: Record=PageOptions|CenterHorizontal=True|CenterVertical=True|PrintScale=0.70|XCorrection=1.00|YCorrection=1.00|PrintKind=2|BorderSize=5000000|LeftOffset=9000|BottomOffset=10100|Orientation=2|PaperLength=11176|PaperWidth=8636|Scale=100|PaperSource=259|PrintQuality=-3|MediaType=1|DitherType=10|PrintScaleMode=1|PaperKind=A3|PaperIndex=8; FirstApplication: -; DocumentName: stm32h7-hmi-display
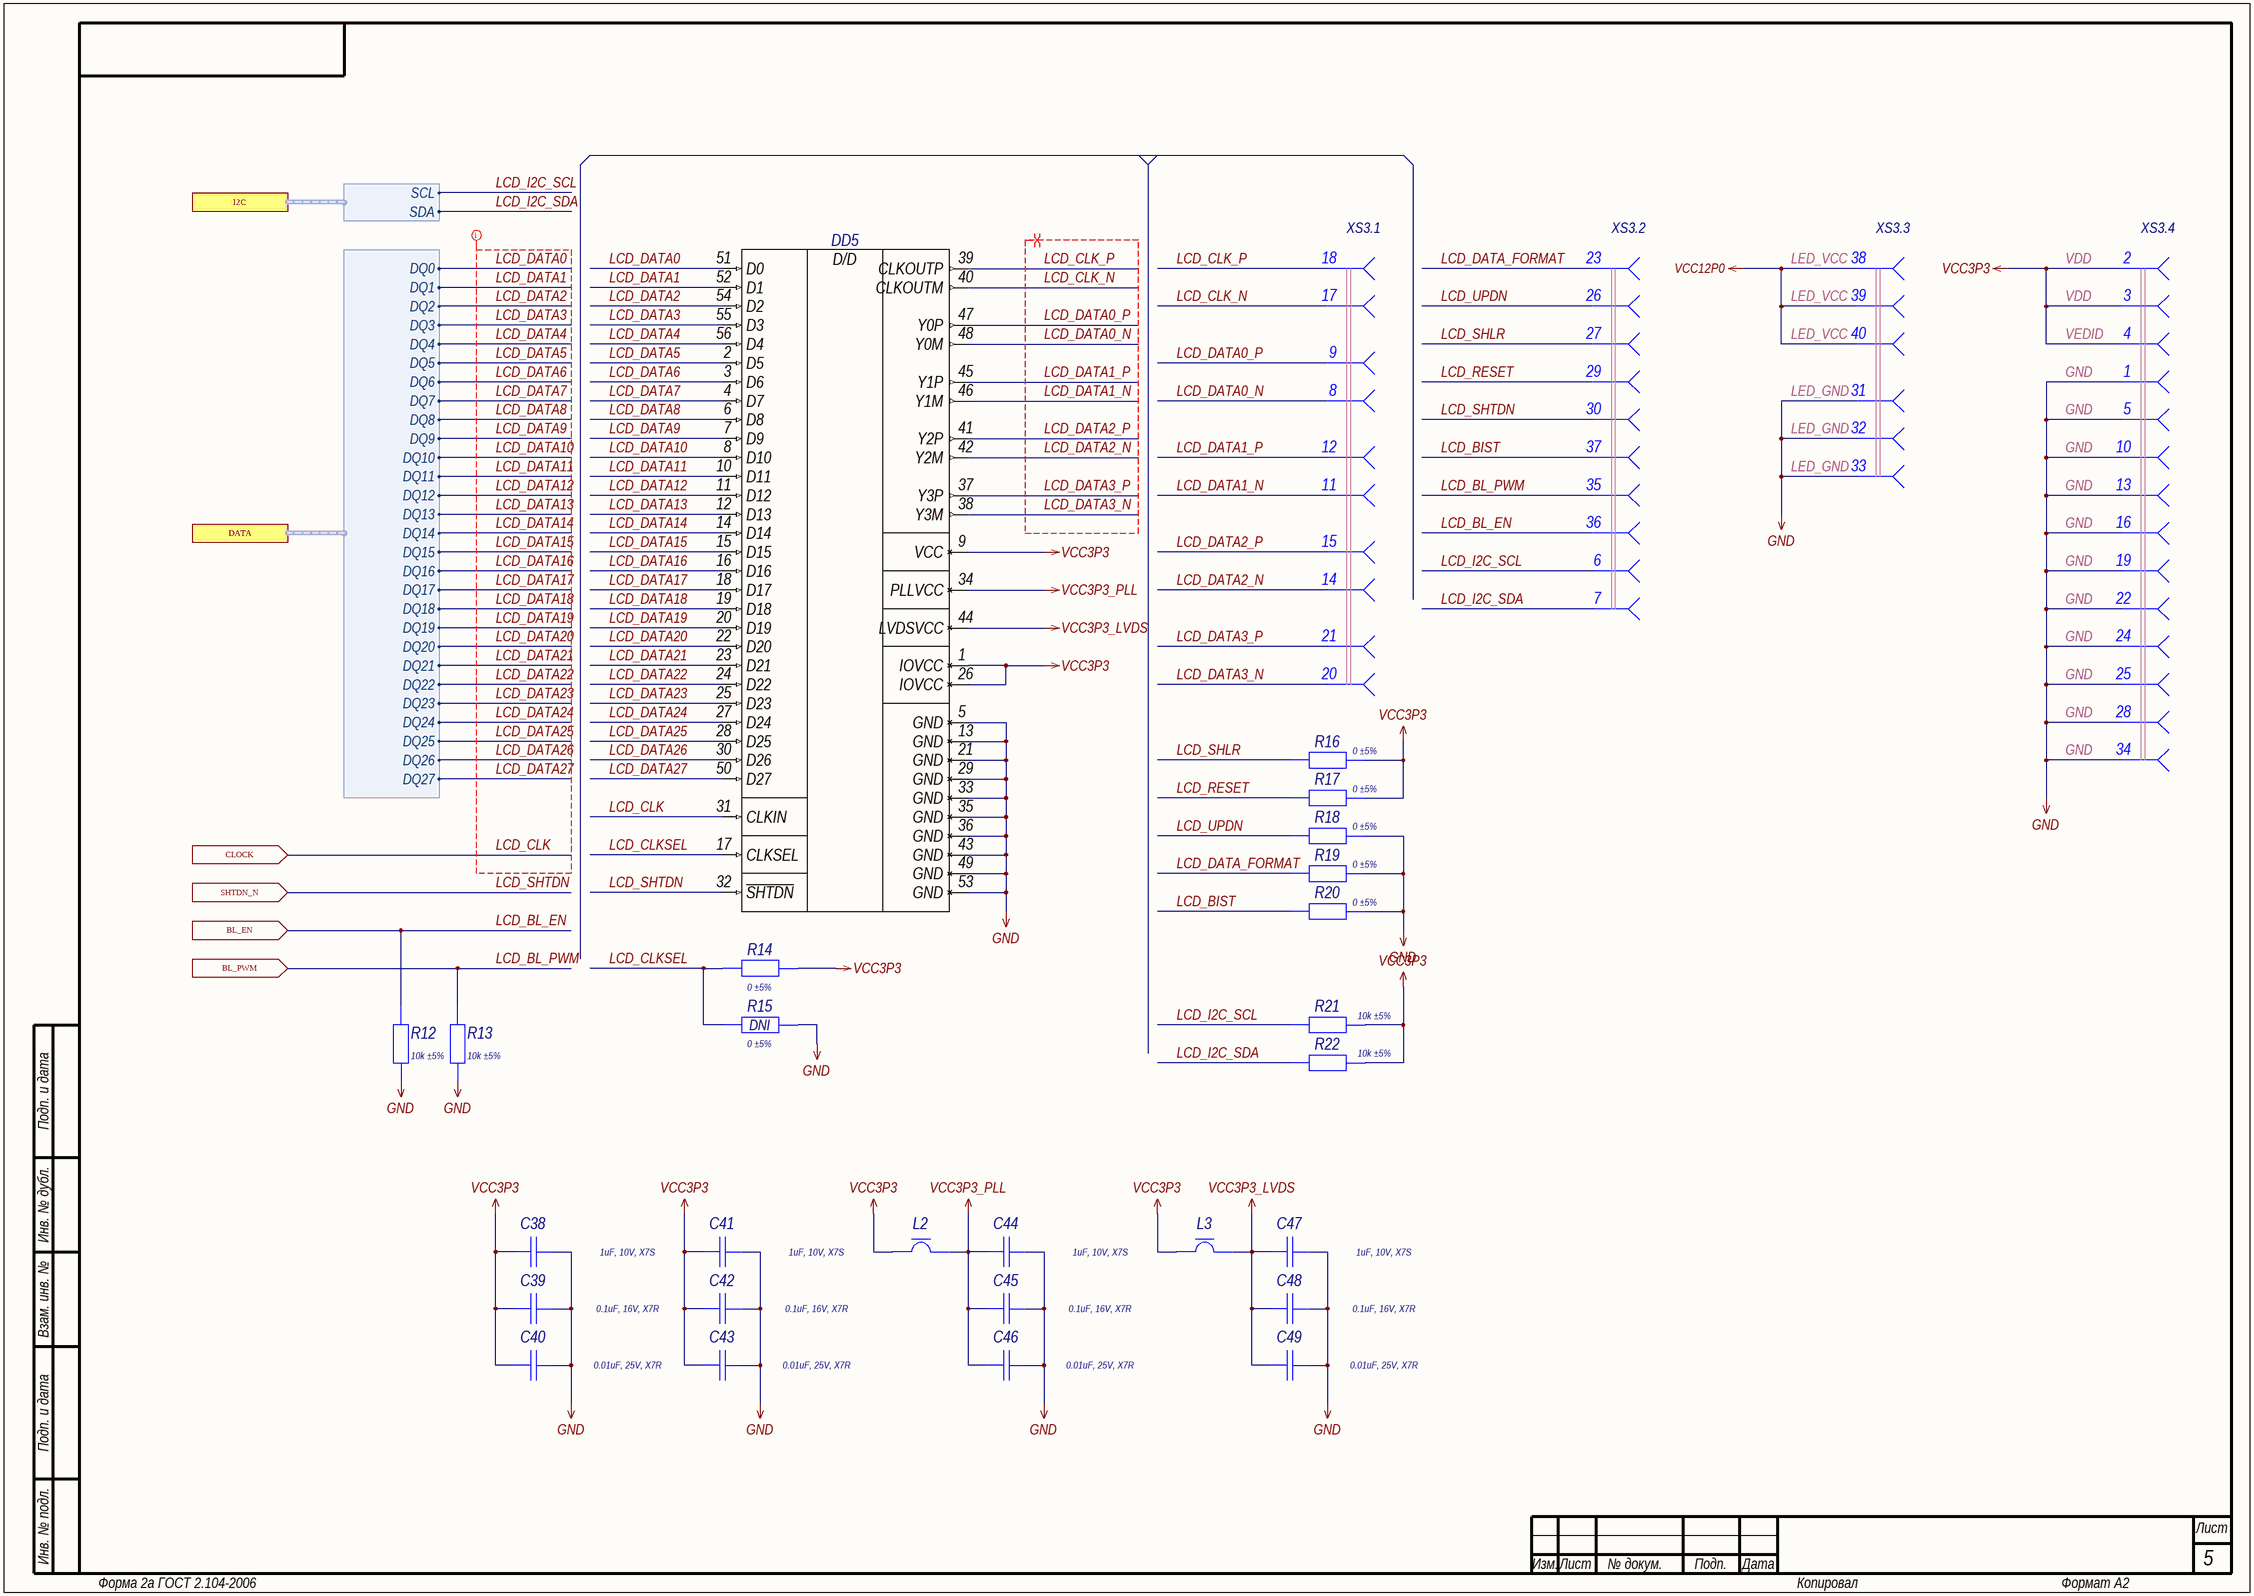
[diagram p4: 05_LCD_LVDS.SchDoc]

### Parts
C38  Schematic Value: 1uF, 10V, X7S  [C0402_L]  (hidden comment: Capacitor)
C39  Schematic Value: 0.1uF, 16V, X7R  [C0402_L]  (hidden comment: Capacitor)
C40  Schematic Value: 0.01uF, 25V, X7R  [C0402_L]  (hidden comment: Capacitor)
C41  Schematic Value: 1uF, 10V, X7S  [C0402_L]  (hidden comment: Capacitor)
C42  Schematic Value: 0.1uF, 16V, X7R  [C0402_L]  (hidden comment: Capacitor)
C43  Schematic Value: 0.01uF, 25V, X7R  [C0402_L]  (hidden comment: Capacitor)
C44  Schematic Value: 1uF, 10V, X7S  [C0402_L]  (hidden comment: Capacitor)
C45  Schematic Value: 0.1uF, 16V, X7R  [C0402_L]  (hidden comment: Capacitor)
C46  Schematic Value: 0.01uF, 25V, X7R  [C0402_L]  (hidden comment: Capacitor)
C47  Schematic Value: 1uF, 10V, X7S  [C0402_L]  (hidden comment: Capacitor)
C48  Schematic Value: 0.1uF, 16V, X7R  [C0402_L]  (hidden comment: Capacitor)
C49  Schematic Value: 0.01uF, 25V, X7R  [C0402_L]  (hidden comment: Capacitor)
DD5  SN65LVDS93ADGG  [TSSOP-56_050P1400X610X120_N]  (value not drawn)
L2  FerriteBead  [L0402_L]  (value not drawn)
L3  FerriteBead  [L0402_L]  (value not drawn)
R12  Schematic Value: 10k ±5%  [R0402_L]  (hidden comment: Resistor)
R13  Schematic Value: 10k ±5%  [R0402_L]  (hidden comment: Resistor)
R14  Schematic Value: 0 ±5%  [R0402_L]  (hidden comment: Resistor)
R15  Schematic Value: 0 ±5%  [R0402_L]  (hidden comment: Resistor)  (no BOM)
R16  Schematic Value: 0 ±5%  [R0402_L]  (hidden comment: Resistor)
R17  Schematic Value: 0 ±5%  [R0402_L]  (hidden comment: Resistor)
R18  Schematic Value: 0 ±5%  [R0402_L]  (hidden comment: Resistor)
R19  Schematic Value: 0 ±5%  [R0402_L]  (hidden comment: Resistor)
R20  Schematic Value: 0 ±5%  [R0402_L]  (hidden comment: Resistor)
R21  Schematic Value: 10k ±5%  [R0402_L]  (hidden comment: Resistor)
R22  Schematic Value: 10k ±5%  [R0402_L]  (hidden comment: Resistor)
XS3  TFT LVDS  [54104-4031]  (value not drawn)  (parts A,B,C,D,E,F,G,H,I,J,K,L,M,N,O,P,Q,R,S,T,U,V,W,X,Y,Z,27,28,29,30,31,32,33,34,35,36,37,38,39,40 of 40)

### Ports
BL_EN (in), BL_PWM (in), CLOCK (in), DATA (harness LCD_DQ), I2C (harness I2C), SHTDN_N (in)

### Harnesses
LCD_DQ: DQ0, DQ1, DQ2, DQ3, DQ4, DQ5, DQ6, DQ7, DQ8, DQ9, DQ10, DQ11, DQ12, DQ13, DQ14, DQ15, DQ16, DQ17, DQ18, DQ19, DQ20, DQ21, DQ22, DQ23, DQ24, DQ25, DQ26, DQ27
I2C: SCL, SDA

### Nets
GND: C38.2 C39.2 C40.2 C41.2 C42.2 C43.2 C44.2 C45.2 C46.2 C47.2 C48.2 C49.2 DD5.5(GND) DD5.13(GND) DD5.21(GND) DD5.29(GND) DD5.33(GND) DD5.35(GND) DD5.36(GND) DD5.43(GND) DD5.49(GND) DD5.53(GND) R12.1 R13.1 R15.2 R18.2 R19.2 R20.2 XS3.1 XS3.5 XS3.10 XS3.13 XS3.16 XS3.19 XS3.22 XS3.24 XS3.25 XS3.28 XS3.31 XS3.32 XS3.33 XS3.34
VCC3P3: C38.1 C39.1 C40.1 C41.1 C42.1 C43.1 DD5.1(IOVCC) DD5.9(VCC) DD5.26(IOVCC) L2.1 L3.1 R14.2 R16.2 R17.2 R21.1 R22.1 XS3.2 XS3.3 XS3.4
VCC3P3_LVDS: C47.1 C48.1 C49.1 DD5.44(LVDSVCC) L3.2
VCC3P3_PLL: C44.1 C45.1 C46.1 DD5.34(PLLVCC) L2.2
VCC12P0: XS3.38 XS3.39 XS3.40
LCD_BIST: R20.1 XS3.37
LCD_BL_EN: R12.2 XS3.36 ; port BL_EN
LCD_BL_PWM: R13.2 XS3.35 ; port BL_PWM
LCD_CLK: DD5.31(CLKIN) ; port CLOCK
LCD_CLK_N: DD5.40(CLKOUTM) XS3.17
LCD_CLK_P: DD5.39(CLKOUTP) XS3.18
LCD_CLKSEL: DD5.17(CLKSEL) R14.1 R15.1
LCD_DATA0: DD5.51(D0) ; port DATA.DQ0
LCD_DATA0_N: DD5.48(Y0M) XS3.8
LCD_DATA0_P: DD5.47(Y0P) XS3.9
LCD_DATA1: DD5.52(D1) ; port DATA.DQ1
LCD_DATA1_N: DD5.46(Y1M) XS3.11
LCD_DATA1_P: DD5.45(Y1P) XS3.12
LCD_DATA2: DD5.54(D2) ; port DATA.DQ2
LCD_DATA2_N: DD5.42(Y2M) XS3.14
LCD_DATA2_P: DD5.41(Y2P) XS3.15
LCD_DATA3: DD5.55(D3) ; port DATA.DQ3
LCD_DATA3_N: DD5.38(Y3M) XS3.20
LCD_DATA3_P: DD5.37(Y3P) XS3.21
LCD_DATA4: DD5.56(D4) ; port DATA.DQ4
LCD_DATA5: DD5.2(D5) ; port DATA.DQ5
LCD_DATA6: DD5.3(D6) ; port DATA.DQ6
LCD_DATA7: DD5.4(D7) ; port DATA.DQ7
LCD_DATA8: DD5.6(D8) ; port DATA.DQ8
LCD_DATA9: DD5.7(D9) ; port DATA.DQ9
LCD_DATA10: DD5.8(D10) ; port DATA.DQ10
LCD_DATA11: DD5.10(D11) ; port DATA.DQ11
LCD_DATA12: DD5.11(D12) ; port DATA.DQ12
LCD_DATA13: DD5.12(D13) ; port DATA.DQ13
LCD_DATA14: DD5.14(D14) ; port DATA.DQ14
LCD_DATA15: DD5.15(D15) ; port DATA.DQ15
LCD_DATA16: DD5.16(D16) ; port DATA.DQ16
LCD_DATA17: DD5.18(D17) ; port DATA.DQ17
LCD_DATA18: DD5.19(D18) ; port DATA.DQ18
LCD_DATA19: DD5.20(D19) ; port DATA.DQ19
LCD_DATA20: DD5.22(D20) ; port DATA.DQ20
LCD_DATA21: DD5.23(D21) ; port DATA.DQ21
LCD_DATA22: DD5.24(D22) ; port DATA.DQ22
LCD_DATA23: DD5.25(D23) ; port DATA.DQ23
LCD_DATA24: DD5.27(D24) ; port DATA.DQ24
LCD_DATA25: DD5.28(D25) ; port DATA.DQ25
LCD_DATA26: DD5.30(D26) ; port DATA.DQ26
LCD_DATA27: DD5.50(D27) ; port DATA.DQ27
LCD_DATA_FORMAT: R19.1 XS3.23
LCD_I2C_SCL: R21.2 XS3.6 ; port I2C.SCL
LCD_I2C_SDA: R22.2 XS3.7 ; port I2C.SDA
LCD_RESET: R17.1 XS3.29
LCD_SHLR: R16.1 XS3.27
LCD_SHTDN: DD5.32(~{SHTDN}) XS3.30 ; port SHTDN_N
LCD_UPDN: R18.1 XS3.26

### Layout directives
differential pair; differential pair class LCD_LVDS: LCD_CLK_N, LCD_CLK_P, LCD_DATA0_N, LCD_DATA0_P, LCD_DATA1_N, LCD_DATA1_P, LCD_DATA2_N, LCD_DATA2_P, LCD_DATA3_N, LCD_DATA3_P
net class LCD: LCD_CLK, LCD_DATA0, LCD_DATA1, LCD_DATA2, LCD_DATA3, LCD_DATA4, LCD_DATA5, LCD_DATA6, LCD_DATA7, LCD_DATA8, LCD_DATA9, LCD_DATA10, LCD_DATA11, LCD_DATA12, LCD_DATA13, LCD_DATA14, LCD_DATA15, LCD_DATA16, LCD_DATA17, LCD_DATA18, LCD_DATA19, LCD_DATA20, LCD_DATA21, LCD_DATA22, LCD_DATA23, LCD_DATA24, LCD_DATA25, LCD_DATA26, LCD_DATA27

### Notes on the sheet
- (near XS3) XS3.1
- (near XS3) XS3.2
- (near XS3) LED_VCC
- (near XS3) XS3.3
- VDD
- (near XS3) XS3.4
- (near XS3) VEDID
- (near XS3) LED_GND
- GND
- (near R15) DNI
- Подп. и дата
- Инв. № дубл.
- Взам. инв. №
- Инв. № подл.
- Изм.
- Лист
- № докум.
- Подп.
- Дата
- Форма 2а ГОСТ 2.104-2006
- Копировал
- Формат А2
- (in symbol SN65LVDS93ADGGR) D/D

### Library data of the parts
C38 C41 C44 C47 = GRM155C71A105KE11D: as C1 on sheet 02_H7_IO; Published: 18.05.2010; Publisher: Andrew Danich; Part Number: GRM155C71A105KE11D; Footprint: 0402
C39 C42 C45 C48 = GCM155R71C104KA55D: as C2 on sheet 02_H7_IO; Published: 18.05.2010; Publisher: Andrew Danich; Part Number: GCM155R71C104KA55D; Footprint: 0402
C40 C43 C46 C49 = GCM155R71E103KA37D: Manufacturer: Murata; Type: Конденсатор; ID: 150; Value: 0.01uF; Voltage: 25V; Tolerance: ±10%; Dielectric Type: X7R; Application Category: 1; Working Temperature Min: -55°С; Working Temperature Max: +125°С; Functional Analog: GRM155R71E103KA01D; Published: 18.05.2010; Publisher: Andrew Danich; Part Number: GCM155R71E103KA37D; Footprint: 0402
DD5 = SN65LVDS93ADGGR: Manufacturer: Texas Instruments; ID: 4; Supply Operation: +1.62…3.6V; Supply Current: 102mA; Number of Receivers: 28; Input Type: LVTTL; Output Type: LVDS; Data Rate: 3780 Mb/s; Application Category: 1; Working Temperature Min: -40°С; Working Temperature Max: +85°С; Published: 19.05.2020; Publisher: Andrew Danich; Type: Микросхема; Part Number: SN65LVDS93ADGGR; Value: SN65LVDS93ADGGR; Number of Drivers: 4; Functional Analog: SN65LVDS93ADGG
L2 L3 = BLM15PD121SN1D: Manufacturer: Murata; Type: Дроссель; ID: 11; Rated Current: 1.3A; Impedance at 100Mhz: 120ohm; Tolerance: ±25%; DC Resistance: 0.09ohm; Inductor Type: EMIFIL; Application Category: 1; Working Temperature Min: -55°С; Working Temperature Max: +125°С; Published: 14.11.2014; Publisher: Andrew Danich; Part Number: BLM15PD121SN1D; Value: BLM15PD121SN1D; Footprint: 0402
R12 R13 R21 R22 = RC0402JR-0710KL: as R6 on sheet 02_H7_IO; Published: 24.03.2010; Publisher: Andrew Danich; Type: Резистор; Part Number: RC0402JR-0710KL; Footprint: 0402
R14-R20 = RC0402JR-070RL: as R1 on sheet 02_H7_IO; Published: 24.03.2010; Publisher: Andrew Danich; Type: Резистор; Part Number: RC0402JR-070RL; Footprint: 0402
XS3 = 54104-4031: Manufacturer: Molex; ID: 13; Limit Voltage: 50V; Limit Current: 500mA; Connector Type: Female; Pitch: 0.5mm; Application Category: 1; Working Temperature Min: -20°С; Working Temperature Max: +85°С; Published: 17.03.2018; Publisher: Andrew Danich; Type: Розетка; Part Number: 54104-4031; Value: 54104-4031; Pins: 40; Series: FFC\FPC

## Sheet 06_ISO_CAN.SchDoc: =GlobalProjectName
size 594 x 420 mm; ApprovedBy: Галкин; CheckedBy: Галкин; Author: Данич; Organization: A_D Electronics; DocumentNumber: - Э3; Revision: 0; SheetNumber: 6; SheetTotal: 8; PageSetup: Record=PageOptions|CenterHorizontal=True|CenterVertical=True|PrintScale=0.70|XCorrection=1.00|YCorrection=1.00|PrintKind=2|BorderSize=5000000|LeftOffset=9000|BottomOffset=10100|Orientation=2|PaperLength=11176|PaperWidth=8636|Scale=100|PaperSource=259|PrintQuality=-3|MediaType=1|DitherType=10|PrintScaleMode=1|PaperKind=A3|PaperIndex=8; FirstApplication: -; DocumentName: stm32h7-hmi-display
Used 2 times, as channels C0, C1. Parts and nets are listed once, with the designators drawn on the sheet.
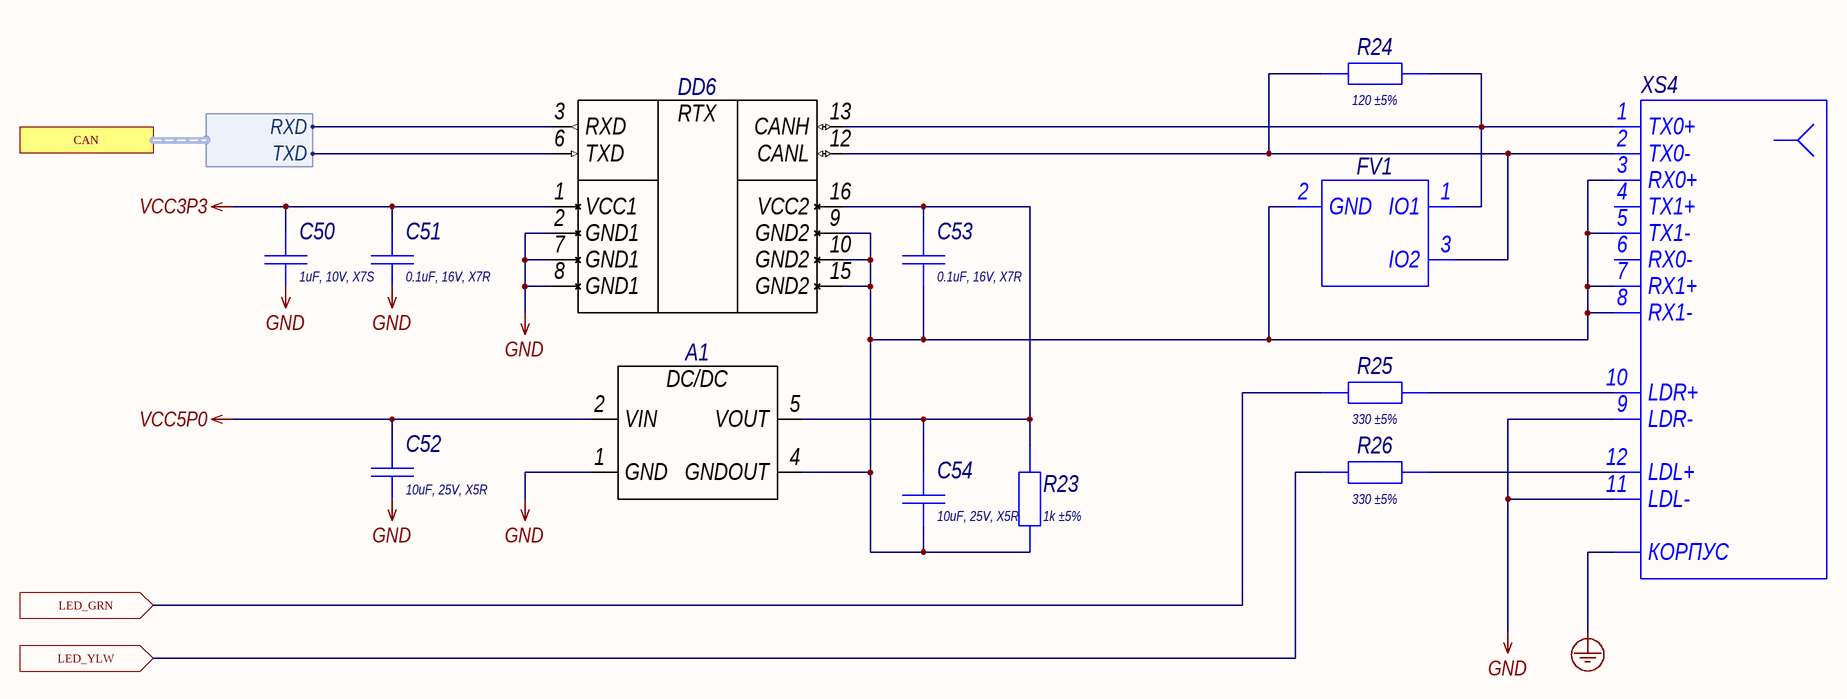
[diagram p5: 06_ISO_CAN.SchDoc]

### Parts
A1  BxxxxXT-1WR3  [BxxxxXT-1WR3]  (value not drawn)
C50  Schematic Value: 1uF, 10V, X7S  [C0402_L]  (hidden comment: Capacitor)
C51  Schematic Value: 0.1uF, 16V, X7R  [C0402_L]  (hidden comment: Capacitor)
C52  Schematic Value: 10uF, 25V, X5R  [C0603_L]  (hidden comment: Capacitor)
C53  Schematic Value: 0.1uF, 16V, X7R  [C0402_L]  (hidden comment: Capacitor)
C54  Schematic Value: 10uF, 25V, X5R  [C0603_L]  (hidden comment: Capacitor)
DD6  ISO1050DW  [SOIC-16_127P1030X750X265_N]  (value not drawn)
FV1  ESDCANxx-2BLY-Series  [SOT-23_190P290X160X145_N]  (value not drawn)
R23  Schematic Value: 1k ±5%  [R0603_L]  (hidden comment: Resistor)
R24  Schematic Value: 120 ±5%  [R0805_L]  (hidden comment: Resistor)
R25  Schematic Value: 330 ±5%  [R0402_L]  (hidden comment: Resistor)
R26  Schematic Value: 330 ±5%  [R0402_L]  (hidden comment: Resistor)
XS4  CAN  [615008137421]  (value not drawn)

### Ports
CAN (harness CAN), LED_GRN (in), LED_YLW (in)

### Harnesses
CAN: RXD, TXD

### Nets
EARTH: XS4.SH(КОРПУС)
GND: A1.1(GND) C50.1 C51.1 C52.1 DD6.2(GND1) DD6.7(GND1) DD6.8(GND1) XS4.9(LDR-) XS4.11(LDL-)
VCC3P3: C50.2 C51.2 DD6.1(VCC1)
VCC5P0: A1.2(VIN) C52.2
LED_GRN: R25.1 ; port LED_GRN
LED_YLW: R26.1 ; port LED_YLW
NetA1_4: A1.4(GNDOUT) C53.1 C54.1 DD6.9(GND2) DD6.10(GND2) DD6.15(GND2) FV1.2(GND) R23.1 XS4.3(RX0+) XS4.5(TX1-) XS4.7(RX1+) XS4.8(RX1-)
NetA1_5: A1.5(VOUT) C53.2 C54.2 DD6.16(VCC2) R23.2
NetDD6_3: DD6.3(RXD) ; port CAN.RXD
NetDD6_6: DD6.6(TXD) ; port CAN.TXD
NetDD6_12: DD6.12(CANL) FV1.3(IO2) R24.1 XS4.2(TX0-)
NetDD6_13: DD6.13(CANH) FV1.1(IO1) R24.2 XS4.1(TX0+)
NetR25_2: R25.2 XS4.10(LDR+)
NetR26_2: R26.2 XS4.12(LDL+)

Not connected (* = marked no-connect by the designer): XS4 4(TX1+) 6(RX0-)

### Channels
C0: designators end in .C0; ports LED_GRN=CAN_GLED0 LED_YLW=CAN_YLED0
C1: designators end in .C1; ports LED_GRN=CAN_GLED1 LED_YLW=CAN_YLED1

### Notes on the sheet
- Подп. и дата
- Инв. № дубл.
- Взам. инв. №
- Инв. № подл.
- Изм.
- Лист
- № докум.
- Подп.
- Дата
- Форма 2а ГОСТ 2.104-2006
- Копировал
- Формат А2
- (in symbol B0505XT-1WR3) DC/DC
- (in symbol ISO1050DWR) RTX

### Library data of the parts
A1 = B0505XT-1WR3: Manufacturer: Mornsun; ID: 5; Supply Operation: +4.5…5.5V; Output Current Min: +20mA; Output Current Max: +200mA; Output Voltage: +5V; I-O Isolation: 1.5kV; Application Category: 1; Working Temperature Min: -40°С; Working Temperature Max: +105°С; Published: 14.04.2020; Publisher: Andrew Danich; Type: Модуль; Part Number: B0505XT-1WR3; Value: B0505XT-1WR3; Functional Analog: -
C50 = GRM155C71A105KE11D: as C1 on sheet 02_H7_IO; Published: 18.05.2010; Publisher: Andrew Danich; Part Number: GRM155C71A105KE11D; Footprint: 0402
C51 C53 = GCM155R71C104KA55D: as C2 on sheet 02_H7_IO; Published: 18.05.2010; Publisher: Andrew Danich; Part Number: GCM155R71C104KA55D; Footprint: 0402
C52 C54 = GRM188R61E106MA73D: Manufacturer: Murata; Type: Конденсатор; ID: 165; Value: 10uF; Voltage: 25V; Tolerance: ±20%; Dielectric Type: X5R; Application Category: 1; Working Temperature Min: -55°С; Working Temperature Max: +85°С; Published: 18.05.2010; Publisher: Andrew Danich; Part Number: GRM188R61E106MA73D; Footprint: 0603
DD6 = ISO1050DWR: Manufacturer: Texas Instruments; ID: 3; Supply Operation: +3.0…5.5V; Supply Current: +70mA; Data Rate: 1Mb/s; Application Type: Transceiver; Input Interface: CAN; Note: Isolated; Application Category: 1; Working Temperature Min: -55°С; Working Temperature Max: +105°С; Published: 14.04.2020; Publisher: Andrew Danich; Type: Микросхема; Part Number: ISO1050DWR; Value: ISO1050DWR; Input Speed: 1Mb/s; Functional Analog: ISO1050DW
FV1 = ESDCAN24-2BLY: Manufacturer: STMicroelectronics; ID: 37; Breakdown Voltage: 27V; Peak Forward Current: 5A; Junction Capacitance: 30pF; Pulse Power Dissipation: 230W; Directional: Bidirectional; Application Category: 1; Working Temperature Min: -40°С; Working Temperature Max: +150°С; Published: 20.05.2020; Publisher: Andrew Danich; Type: Супрессор; Part Number: ESDCAN24-2BLY; Value: ESDCAN24-2BLY
R23 = RC0603JR-071KL: Manufacturer: Yageo; ID: 19; Value: 1k; Limit Voltage: 50V; Tolerance: ±5%; Temperature Coefficient: 100ppm; Total Power Dissipation: 0.1W; Series Type: Thick-Film; Application Category: 1; Working Temperature Min: -55°С; Working Temperature Max: +155°С; Functional Analog: CR0603-JW-102E; Published: 24.03.2010; Publisher: Andrew Danich; Type: Резистор; Part Number: RC0603JR-071KL; Footprint: 0603
R24 = RC0805JR-07120RL: Manufacturer: Yageo; ID: 102; Value: 120; Limit Voltage: 150V; Tolerance: ±5%; Temperature Coefficient: 100ppm; Total Power Dissipation: 0.125W; Series Type: Thick-Film; Application Category: 1; Working Temperature Min: -55°С; Working Temperature Max: +155°С; Published: 24.03.2010; Publisher: Andrew Danich; Type: Резистор; Part Number: RC0805JR-07120RL; Footprint: 0805
R25 R26 = RC0402JR-07330RL: Manufacturer: Yageo; ID: 478; Value: 330; Limit Voltage: 50V; Tolerance: ±5%; Temperature Coefficient: 100ppm; Total Power Dissipation: 0.1W; Series Type: Thick-Film; Application Category: 1; Working Temperature Min: -55°С; Working Temperature Max: +155°С; Published: 24.03.2010; Publisher: Andrew Danich; Type: Резистор; Part Number: RC0402JR-07330RL; Footprint: 0402
XS4 = 615008137421: Manufacturer: Wurth Elektronik; ID: 43; Limit Voltage: 120V; Limit Current: 1.5A; PoE: Yes; Leds: Yellow/Green; Interface: Ethernet/Int.Trans.; Max Data Rate: 1Gbs; Application Category: 1; Working Temperature Min: -40°С; Working Temperature Max: +85°С; Functional Analog: DS1128-09-S8B8S, TJ18-L8P8C-5; Published: 20.05.2020; Publisher: Andrew Danich; Type: Розетка; Part Number: 615008137421; Value: 615008137421; Pins: 12

## Sheet 07_WI-FI.SchDoc: =GlobalProjectName
size 594 x 420 mm; ApprovedBy: Галкин; CheckedBy: Галкин; Author: Данич; Organization: A_D Electronics; DocumentNumber: - Э3; Revision: 0; SheetNumber: 7; SheetTotal: 8; PageSetup: Record=PageOptions|CenterHorizontal=True|CenterVertical=True|PrintScale=0.70|XCorrection=1.00|YCorrection=1.00|PrintKind=2|BorderSize=5000000|LeftOffset=9000|BottomOffset=10100|Orientation=2|PaperLength=11176|PaperWidth=8636|Scale=100|PaperSource=259|PrintQuality=-3|MediaType=1|DitherType=10|PrintScaleMode=1|PaperKind=A3|PaperIndex=8; FirstApplication: -; DocumentName: stm32h7-hmi-display
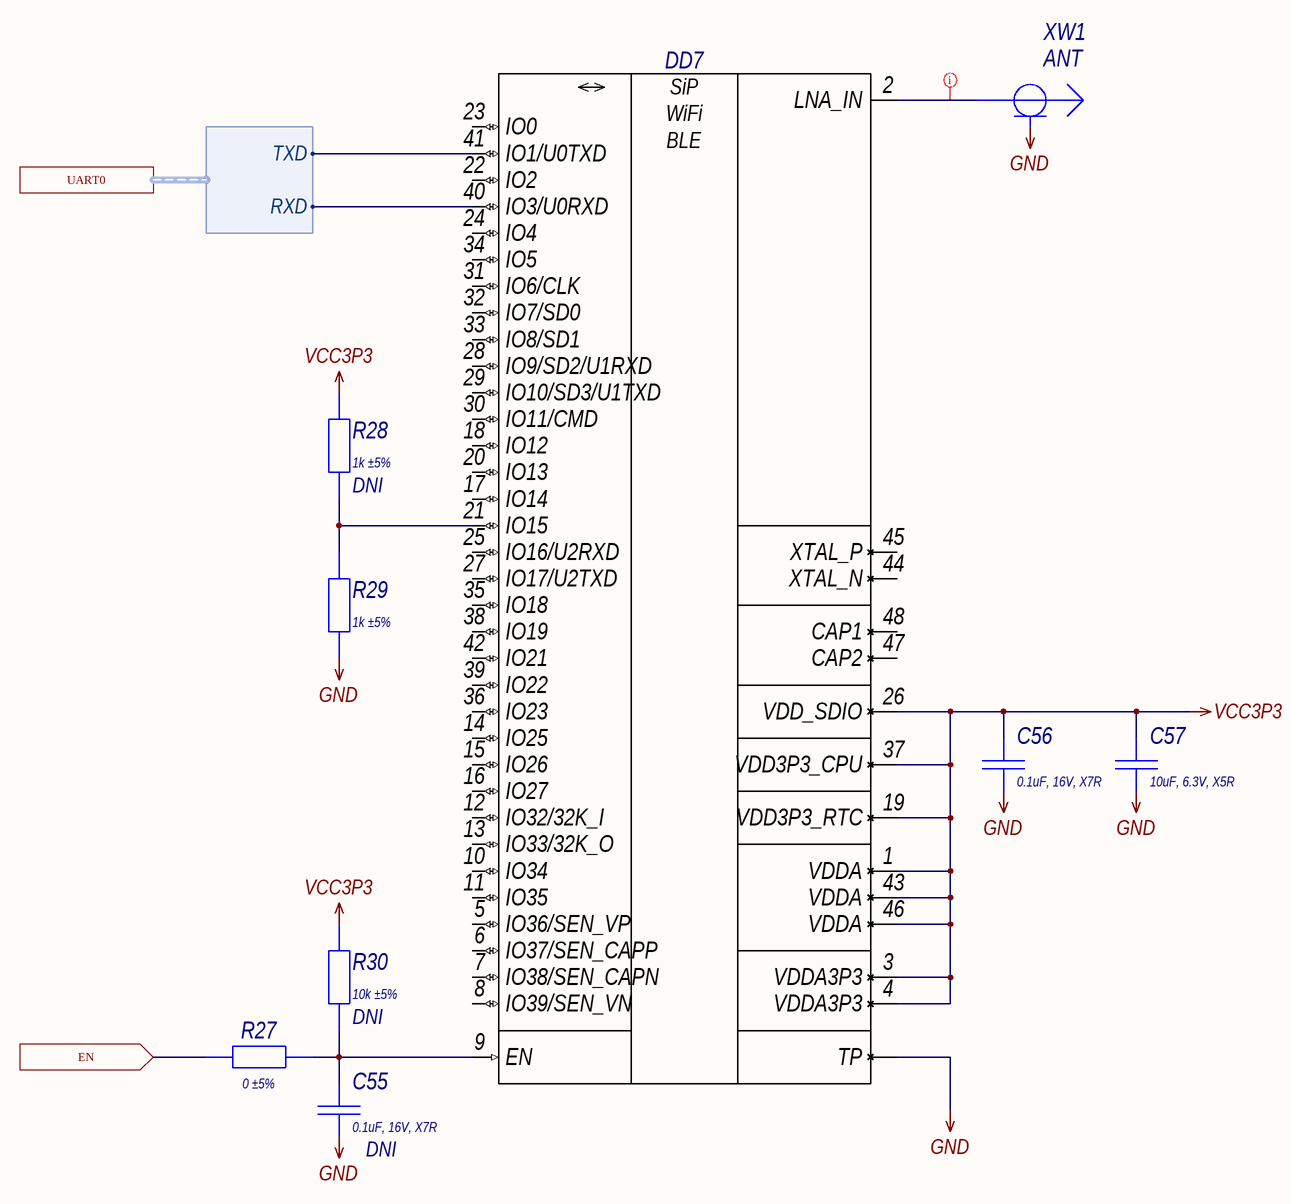
[diagram p6: 07_WI-FI.SchDoc]

### Parts
C55  Schematic Value: 0.1uF, 16V, X7R  [C0402_L]  (hidden comment: Capacitor)  (no BOM)
C56  Schematic Value: 0.1uF, 16V, X7R  [C0402_L]  (hidden comment: Capacitor)
C57  Schematic Value: 10uF, 6.3V, X5R  [C0402_L]  (hidden comment: Capacitor)
DD7  ESP32-PICO-D4  [QFN-48_050P700X700X104_N]  (value not drawn)
R27  Schematic Value: 0 ±5%  [R0402_L]  (hidden comment: Resistor)
R28  Schematic Value: 1k ±5%  [R0402_L]  (hidden comment: Resistor)  (no BOM)
R29  Schematic Value: 1k ±5%  [R0402_L]  (hidden comment: Resistor)
R30  Schematic Value: 10k ±5%  [R0402_L]  (hidden comment: Resistor)  (no BOM)
XW1  ANT  [1909763-1]

### Ports
EN (in), UART0 (harness UART0)

### Harnesses
UART0: RXD, TXD

### Nets
GND: C55.1 C56.1 C57.1 DD7.TP R29.1 XW1.2
VCC3P3: C56.2 C57.2 DD7.1(VDDA) DD7.3(VDDA3P3) DD7.4(VDDA3P3) DD7.19(VDD3P3_RTC) DD7.26(VDD_SDIO) DD7.37(VDD3P3_CPU) DD7.43(VDDA) DD7.46(VDDA) R28.2 R30.2
LCD_SHTDN: R27.1 ; port EN
WIFI_RX: DD7.41(IO1/U0TXD) ; port UART0.TXD
WIFI_TX: DD7.40(IO3/U0RXD) ; port UART0.RXD
NetC55_2: C55.2 DD7.9(EN) R27.2 R30.1
NetDD7_2: DD7.2(LNA_IN) XW1.1
NetDD7_21: DD7.21(IO15) R28.1 R29.2

Not connected (* = marked no-connect by the designer): DD7 5(IO36/SEN_VP) 6(IO37/SEN_CAPP) 7(IO38/SEN_CAPN) 8(IO39/SEN_VN) 10(IO34) 11(IO35) 12(IO32/32K_I) 13(IO33/32K_O) 14(IO25) 15(IO26) 16(IO27) 17(IO14) 18(IO12) 20(IO13) 22(IO2) 23(IO0) 24(IO4) 25(IO16/U2RXD) 27(IO17/U2TXD) 28(IO9/SD2/U1RXD) 29(IO10/SD3/U1TXD) 30(IO11/CMD) 31(IO6/CLK) 32(IO7/SD0) 33(IO8/SD1) 34(IO5) 35(IO18) 36(IO23) 38(IO19) 39(IO22) 42(IO21) 44(XTAL_N) 45(XTAL_P) 47(CAP2) 48(CAP1)

### Layout directives
net class RF: NetDD7_2

### Notes on the sheet
- (near R28) DNI
- (near R30) DNI
- (near C55) DNI
- Подп. и дата
- Инв. № дубл.
- Взам. инв. №
- Инв. № подл.
- Изм.
- Лист
- № докум.
- Подп.
- Дата
- Форма 2а ГОСТ 2.104-2006
- Копировал
- Формат А2
- (in symbol ESP32-PICO-D4) SiP; WiFi; BLE

### Library data of the parts
C55 C56 = GCM155R71C104KA55D: as C2 on sheet 02_H7_IO; Published: 18.05.2010; Publisher: Andrew Danich; Part Number: GCM155R71C104KA55D; Footprint: 0402
C57 = GRM155R60J106ME15D: as C3 on sheet 02_H7_IO; Published: 18.05.2010; Publisher: Andrew Danich; Part Number: GRM155R60J106ME15D; Footprint: 0402
DD7 = ESP32-PICO-D4: Manufacturer: Espressif Systems; ID: 1; Supply Operation: +500mA; Supply Current: +2.7…3.6V; ROM/RAM: 4M/; Wireless Compatibility: Wi-Fi, Bluetooth; Supported Interfaces: GPIO, I2C, I2S, SPI, UART, SDIO, ADC, DAC; I/O Lines: 34; Operation Frequency: 240 MHz; Working Temperature Min: -40°С; Working Temperature Max: +85°С; Published: 20.05.2020; Publisher: Andrew Danich; Type: Модуль; Part Number: ESP32-PICO-D4; Value: ESP32-PICO-D4; Application Category: 1
R27 = RC0402JR-070RL: as R1 on sheet 02_H7_IO; Published: 24.03.2010; Publisher: Andrew Danich; Type: Резистор; Part Number: RC0402JR-070RL; Footprint: 0402
R28 R29 = RC0402JR-071KL: Manufacturer: Yageo; ID: 3; Value: 1k; Limit Voltage: 50V; Tolerance: ±5%; Temperature Coefficient: 100ppm; Total Power Dissipation: 0.1W; Series Type: Thick-Film; Application Category: 1; Working Temperature Min: -55°С; Working Temperature Max: +155°С; Published: 24.03.2010; Publisher: Andrew Danich; Type: Резистор; Part Number: RC0402JR-071KL; Footprint: 0402
R30 = RC0402JR-0710KL: as R6 on sheet 02_H7_IO; Published: 24.03.2010; Publisher: Andrew Danich; Type: Резистор; Part Number: RC0402JR-0710KL; Footprint: 0402
XW1 = 1909763-1: Manufacturer: TE Connectivity; ID: 3; Connector Type: Male; Wave Resistance: 50ohm; Surface Finish: Gold; Frequency Band: 6GHz; Application Category: 1; Working Temperature Min: -40°С; Working Temperature Max: +90°С; Published: 19.09.2015; Publisher: НТЦ "Вектор"; Type: Вилка; Part Number: 1909763-1; Value: 1909763-1; Pins: 3; ClassName: DirectConnect